# Altium project roach2_project.PrjPCB (part 8 of 13)

## Sheet v6_io_23_24_25_26.SchDoc: Virtex-6 IO Banks 23, 24, 25 & 26
size A3; Date: DO NOT USE, RATHER USE PROJ OPTIONS; DrawnBy: DO NOT USE, RATHER USE PROJ OPTIONS; Engineer: DO NOT USE, RATHER USE PROJ OPTIONS; Organization: DO NOT USE, RATHER USE PROJ OPTIONS; DocumentNumber: DO NOT USE, RATHER USE PROJ OPTIONS; Revision: DO NOT USE, RATHER USE PROJ OPTIONS; SheetNumber: 15; SheetTotal: 27; SCH_Sheet_Filename: v6_config_io_23_24_25_26.SchDoc; CurrentTime: DO NOT USE, RATHER USE PROJ OPTIONS; Time: DO NOT USE, RATHER USE PROJ OPTIONS; DocumentFullPathAndName: DO NOT USE, RATHER USE PROJ OPTIONS; DocumentName: DO NOT USE, RATHER USE PROJ OPTIONS; ModifiedDate: DO NOT USE, RATHER USE PROJ OPTIONS; ImagePath: DO NOT USE, RATHER USE PROJ OPTIONS
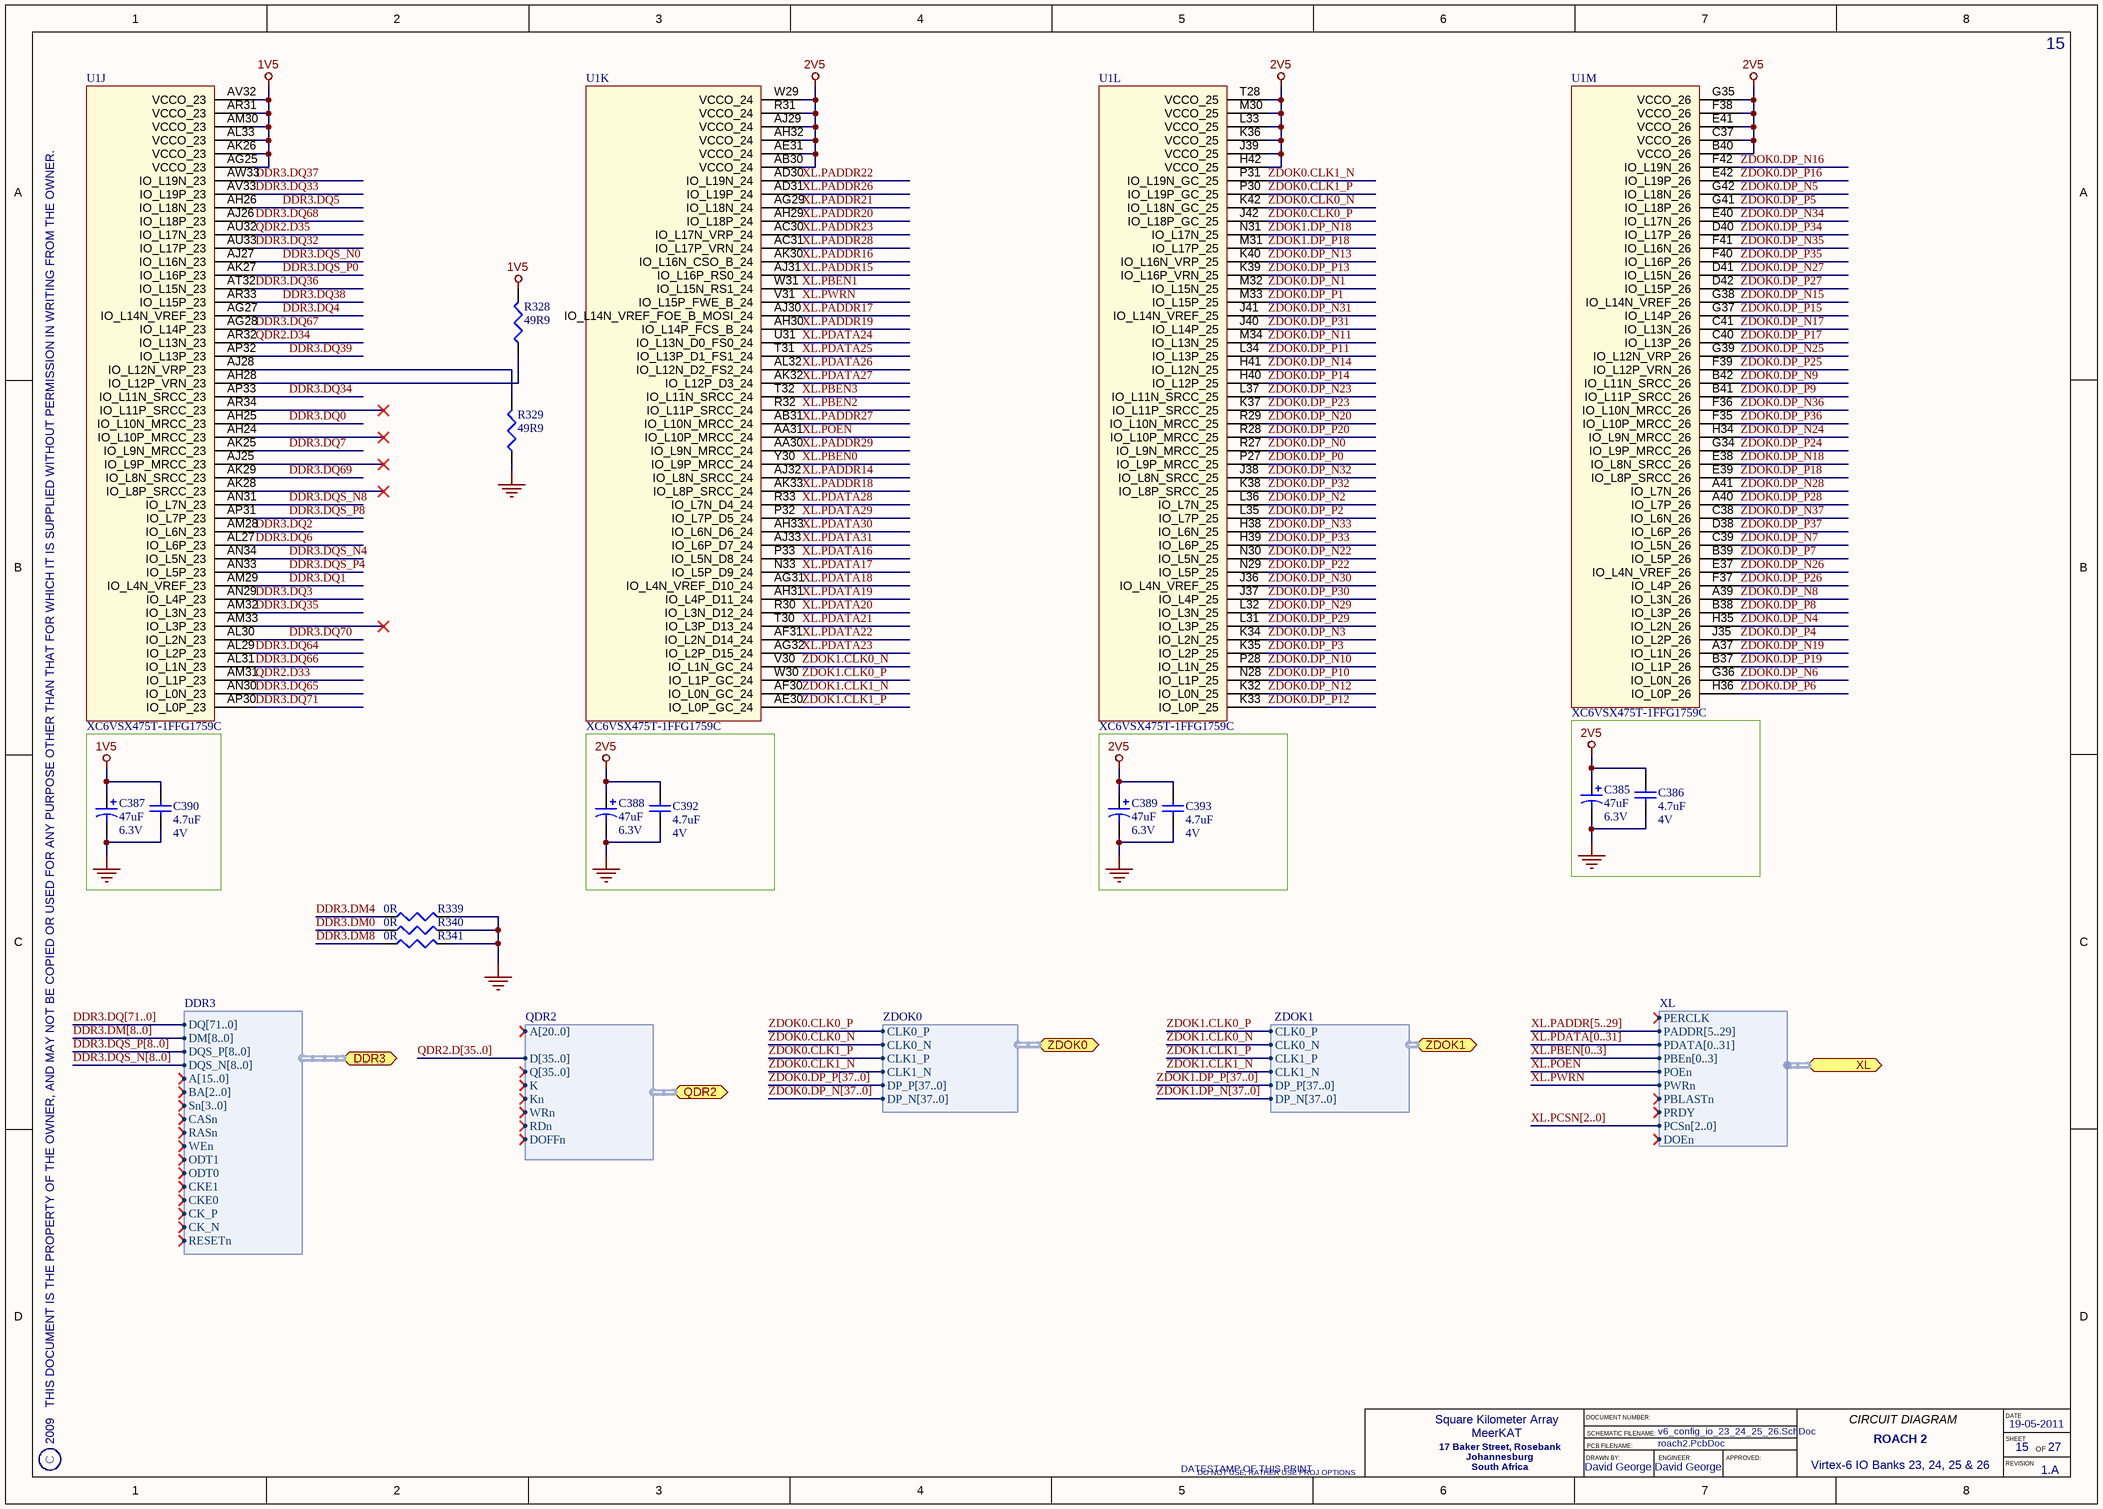
[diagram p15: v6_io_23_24_25_26.SchDoc]

### Parts
C385  Rating: 6.3V  [CAPMP3528X120L]  (hidden comment: 47uF)
C386  Rating: 4V  [CAPC1005X60L]  (hidden comment: 4.7uF)
C387  Rating: 6.3V  [CAPMP3528X120L]  (hidden comment: 47uF)
C388  Rating: 6.3V  [CAPMP3528X120L]  (hidden comment: 47uF)
C389  Rating: 6.3V  [CAPMP3528X120L]  (hidden comment: 47uF)
C390  Rating: 4V  [CAPC1005X60L]  (hidden comment: 4.7uF)
C392  Rating: 4V  [CAPC1005X60L]  (hidden comment: 4.7uF)
C393  Rating: 4V  [CAPC1005X60L]  (hidden comment: 4.7uF)
R328  49R9  [RESC1005X40L]
R329  49R9  [RESC1005X40L]
R339  0R  [RESC1005X40L]
R340  0R  [RESC1005X40L]
R341  0R  [RESC1005X40L]
U1  XC6VSX475T-1FFG1759C  [FFG1759]  (parts J,K,L,M of 39)

### Ports
DDR3 (harness DDR3), QDR2 (harness QDR2), XL (harness XL), ZDOK0 (harness ZDOK0), ZDOK1 (harness ZDOK1)

### Harnesses
ZDOK1: CLK0_P, CLK0_N, CLK1_P, CLK1_N, DP_P[37..0], DP_N[37..0]
QDR2: A[20..0], D[35..0], Q[35..0], K, Kn, WRn, RDn, DOFFn
DDR3: DQ[71..0], DM[8..0], DQS_P[8..0], DQS_N[8..0], A[15..0], BA[2..0], Sn[3..0], CASn, RASn, WEn, ODT1, ODT0, CKE1, CKE0, CK_P, CK_N, RESETn
ZDOK0: CLK0_P, CLK0_N, CLK1_P, CLK1_N, DP_P[37..0], DP_N[37..0]
XL: PERCLK, PADDR[5..29], PDATA[0..31], PBEn[0..3], POEn, PWRn, PBLASTn, PRDY, PCSn[2..0], DOEn

### Nets
1V5: C387.1 C390.2 R328.2 U1.AG25(VCCO_23) U1.AK26(VCCO_23) U1.AL33(VCCO_23) U1.AM30(VCCO_23) U1.AR31(VCCO_23) U1.AV32(VCCO_23)
2V5: C385.1 C386.2 C388.1 C389.1 C392.2 C393.2 U1.AB30(VCCO_24) U1.AE31(VCCO_24) U1.AH32(VCCO_24) U1.AJ29(VCCO_24) U1.B40(VCCO_26) U1.C37(VCCO_26) U1.E41(VCCO_26) U1.F38(VCCO_26) U1.G35(VCCO_26) U1.H42(VCCO_25) U1.J39(VCCO_25) U1.K36(VCCO_25) U1.L33(VCCO_25) U1.M30(VCCO_25) U1.R31(VCCO_24) U1.T28(VCCO_25) U1.W29(VCCO_24)
GND: C385.2 C386.1 C387.2 C388.2 C389.2 C390.1 C392.1 C393.1 R329.1 R339.2 R340.2 R341.2
DDR3.DM0: R340.1
DDR3.DM4: R339.1
DDR3.DM8: R341.1
DDR3.DQ0: U1.AH25(IO_L10N_MRCC_23)
DDR3.DQ1: U1.AM29(IO_L4N_VREF_23)
DDR3.DQ2: U1.AM28(IO_L6N_23)
DDR3.DQ3: U1.AN29(IO_L4P_23)
DDR3.DQ4: U1.AG27(IO_L14N_VREF_23)
DDR3.DQ5: U1.AH26(IO_L18N_23)
DDR3.DQ6: U1.AL27(IO_L6P_23)
DDR3.DQ7: U1.AK25(IO_L9N_MRCC_23)
DDR3.DQ32: U1.AU33(IO_L17P_23)
DDR3.DQ33: U1.AV33(IO_L19P_23)
DDR3.DQ34: U1.AP33(IO_L11N_SRCC_23)
DDR3.DQ35: U1.AM32(IO_L3N_23)
DDR3.DQ36: U1.AT32(IO_L15N_23)
DDR3.DQ37: U1.AW33(IO_L19N_23)
DDR3.DQ38: U1.AR33(IO_L15P_23)
DDR3.DQ39: U1.AP32(IO_L13P_23)
DDR3.DQ64: U1.AL29(IO_L2P_23)
DDR3.DQ65: U1.AN30(IO_L0N_23)
DDR3.DQ66: U1.AL31(IO_L1N_23)
DDR3.DQ67: U1.AG28(IO_L14P_23)
DDR3.DQ68: U1.AJ26(IO_L18P_23)
DDR3.DQ69: U1.AK29(IO_L8N_SRCC_23)
DDR3.DQ70: U1.AL30(IO_L2N_23)
DDR3.DQ71: U1.AP30(IO_L0P_23)
DDR3.DQS_N0: U1.AJ27(IO_L16N_23)
DDR3.DQS_N4: U1.AN34(IO_L5N_23)
DDR3.DQS_N8: U1.AN31(IO_L7N_23)
DDR3.DQS_P0: U1.AK27(IO_L16P_23)
DDR3.DQS_P4: U1.AN33(IO_L5P_23)
DDR3.DQS_P8: U1.AP31(IO_L7P_23)
QDR2.D33: U1.AM31(IO_L1P_23)
QDR2.D34: U1.AR32(IO_L13N_23)
QDR2.D35: U1.AU32(IO_L17N_23)
XL.PADDR14: U1.AJ32(IO_L8N_SRCC_24)
XL.PADDR15: U1.AJ31(IO_L16P_RS0_24)
XL.PADDR16: U1.AK30(IO_L16N_CSO_B_24)
XL.PADDR17: U1.AJ30(IO_L14N_VREF_FOE_B_MOSI_24)
XL.PADDR18: U1.AK33(IO_L8P_SRCC_24)
XL.PADDR19: U1.AH30(IO_L14P_FCS_B_24)
XL.PADDR20: U1.AH29(IO_L18P_24)
XL.PADDR21: U1.AG29(IO_L18N_24)
XL.PADDR22: U1.AD30(IO_L19N_24)
XL.PADDR23: U1.AC30(IO_L17N_VRP_24)
XL.PADDR26: U1.AD31(IO_L19P_24)
XL.PADDR27: U1.AB31(IO_L10N_MRCC_24)
XL.PADDR28: U1.AC31(IO_L17P_VRN_24)
XL.PADDR29: U1.AA30(IO_L9N_MRCC_24)
XL.PBEn0: U1.Y30(IO_L9P_MRCC_24)
XL.PBEn1: U1.W31(IO_L15N_RS1_24)
XL.PBEn2: U1.R32(IO_L11P_SRCC_24)
XL.PBEn3: U1.T32(IO_L11N_SRCC_24)
XL.PDATA16: U1.P33(IO_L5N_D8_24)
XL.PDATA17: U1.N33(IO_L5P_D9_24)
XL.PDATA18: U1.AG31(IO_L4N_VREF_D10_24)
XL.PDATA19: U1.AH31(IO_L4P_D11_24)
XL.PDATA20: U1.R30(IO_L3N_D12_24)
XL.PDATA21: U1.T30(IO_L3P_D13_24)
XL.PDATA22: U1.AF31(IO_L2N_D14_24)
XL.PDATA23: U1.AG32(IO_L2P_D15_24)
XL.PDATA24: U1.U31(IO_L13N_D0_FS0_24)
XL.PDATA25: U1.T31(IO_L13P_D1_FS1_24)
XL.PDATA26: U1.AL32(IO_L12N_D2_FS2_24)
XL.PDATA27: U1.AK32(IO_L12P_D3_24)
XL.PDATA28: U1.R33(IO_L7N_D4_24)
XL.PDATA29: U1.P32(IO_L7P_D5_24)
XL.PDATA30: U1.AH33(IO_L6N_D6_24)
XL.PDATA31: U1.AJ33(IO_L6P_D7_24)
XL.POEn: U1.AA31(IO_L10P_MRCC_24) ; port XL.POEn
XL.PWRn: U1.V31(IO_L15P_FWE_B_24) ; port XL.PWRn
ZDOK0.CLK0_N: U1.K42(IO_L18N_GC_25) ; port ZDOK0.CLK0_N
ZDOK0.CLK0_P: U1.J42(IO_L18P_GC_25) ; port ZDOK0.CLK0_P
ZDOK0.CLK1_N: U1.P31(IO_L19N_GC_25) ; port ZDOK0.CLK1_N
ZDOK0.CLK1_P: U1.P30(IO_L19P_GC_25) ; port ZDOK0.CLK1_P
ZDOK0.DP_N0: U1.R27(IO_L9N_MRCC_25)
ZDOK0.DP_N1: U1.M32(IO_L15N_25)
ZDOK0.DP_N2: U1.L36(IO_L7N_25)
ZDOK0.DP_N3: U1.K34(IO_L2N_25)
ZDOK0.DP_N4: U1.H35(IO_L2N_26)
ZDOK0.DP_N5: U1.G42(IO_L18N_26)
ZDOK0.DP_N6: U1.G36(IO_L0N_26)
ZDOK0.DP_N7: U1.C39(IO_L5N_26)
ZDOK0.DP_N8: U1.A39(IO_L3N_26)
ZDOK0.DP_N9: U1.B42(IO_L11N_SRCC_26)
ZDOK0.DP_N10: U1.P28(IO_L1N_25)
ZDOK0.DP_N11: U1.M34(IO_L13N_25)
ZDOK0.DP_N12: U1.K32(IO_L0N_25)
ZDOK0.DP_N13: U1.K40(IO_L16N_VRP_25)
ZDOK0.DP_N14: U1.H41(IO_L12N_25)
ZDOK0.DP_N15: U1.G38(IO_L14N_VREF_26)
ZDOK0.DP_N16: U1.F42(IO_L19N_26)
ZDOK0.DP_N17: U1.C41(IO_L13N_26)
ZDOK0.DP_N18: U1.E38(IO_L8N_SRCC_26)
ZDOK0.DP_N19: U1.A37(IO_L1N_26)
ZDOK0.DP_N20: U1.R29(IO_L10N_MRCC_25)
ZDOK0.DP_N22: U1.N30(IO_L5N_25)
ZDOK0.DP_N23: U1.L37(IO_L11N_SRCC_25)
ZDOK0.DP_N24: U1.H34(IO_L9N_MRCC_26)
ZDOK0.DP_N25: U1.G39(IO_L12N_VRP_26)
ZDOK0.DP_N26: U1.E37(IO_L4N_VREF_26)
ZDOK0.DP_N27: U1.D41(IO_L15N_26)
ZDOK0.DP_N28: U1.A41(IO_L7N_26)
ZDOK0.DP_N29: U1.L32(IO_L3N_25)
ZDOK0.DP_N30: U1.J36(IO_L4N_VREF_25)
ZDOK0.DP_N31: U1.J41(IO_L14N_VREF_25)
ZDOK0.DP_N32: U1.J38(IO_L8N_SRCC_25)
ZDOK0.DP_N33: U1.H38(IO_L6N_25)
ZDOK0.DP_N34: U1.E40(IO_L17N_26)
ZDOK0.DP_N35: U1.F41(IO_L16N_26)
ZDOK0.DP_N36: U1.F36(IO_L10N_MRCC_26)
ZDOK0.DP_N37: U1.C38(IO_L6N_26)
ZDOK0.DP_P0: U1.P27(IO_L9P_MRCC_25)
ZDOK0.DP_P1: U1.M33(IO_L15P_25)
ZDOK0.DP_P2: U1.L35(IO_L7P_25)
ZDOK0.DP_P3: U1.K35(IO_L2P_25)
ZDOK0.DP_P4: U1.J35(IO_L2P_26)
ZDOK0.DP_P5: U1.G41(IO_L18P_26)
ZDOK0.DP_P6: U1.H36(IO_L0P_26)
ZDOK0.DP_P7: U1.B39(IO_L5P_26)
ZDOK0.DP_P8: U1.B38(IO_L3P_26)
ZDOK0.DP_P9: U1.B41(IO_L11P_SRCC_26)
ZDOK0.DP_P10: U1.N28(IO_L1P_25)
ZDOK0.DP_P11: U1.L34(IO_L13P_25)
ZDOK0.DP_P12: U1.K33(IO_L0P_25)
ZDOK0.DP_P13: U1.K39(IO_L16P_VRN_25)
ZDOK0.DP_P14: U1.H40(IO_L12P_25)
ZDOK0.DP_P15: U1.G37(IO_L14P_26)
ZDOK0.DP_P16: U1.E42(IO_L19P_26)
ZDOK0.DP_P17: U1.C40(IO_L13P_26)
ZDOK0.DP_P18: U1.E39(IO_L8P_SRCC_26)
ZDOK0.DP_P19: U1.B37(IO_L1P_26)
ZDOK0.DP_P20: U1.R28(IO_L10P_MRCC_25)
ZDOK0.DP_P22: U1.N29(IO_L5P_25)
ZDOK0.DP_P23: U1.K37(IO_L11P_SRCC_25)
ZDOK0.DP_P24: U1.G34(IO_L9P_MRCC_26)
ZDOK0.DP_P25: U1.F39(IO_L12P_VRN_26)
ZDOK0.DP_P26: U1.F37(IO_L4P_26)
ZDOK0.DP_P27: U1.D42(IO_L15P_26)
ZDOK0.DP_P28: U1.A40(IO_L7P_26)
ZDOK0.DP_P29: U1.L31(IO_L3P_25)
ZDOK0.DP_P30: U1.J37(IO_L4P_25)
ZDOK0.DP_P31: U1.J40(IO_L14P_25)
ZDOK0.DP_P32: U1.K38(IO_L8P_SRCC_25)
ZDOK0.DP_P33: U1.H39(IO_L6P_25)
ZDOK0.DP_P34: U1.D40(IO_L17P_26)
ZDOK0.DP_P35: U1.F40(IO_L16P_26)
ZDOK0.DP_P36: U1.F35(IO_L10P_MRCC_26)
ZDOK0.DP_P37: U1.D38(IO_L6P_26)
ZDOK1.CLK0_N: U1.V30(IO_L1N_GC_24) ; port ZDOK1.CLK0_N
ZDOK1.CLK0_P: U1.W30(IO_L1P_GC_24) ; port ZDOK1.CLK0_P
ZDOK1.CLK1_N: U1.AF30(IO_L0N_GC_24) ; port ZDOK1.CLK1_N
ZDOK1.CLK1_P: U1.AE30(IO_L0P_GC_24) ; port ZDOK1.CLK1_P
ZDOK1.DP_N18: U1.N31(IO_L17N_25)
ZDOK1.DP_P18: U1.M31(IO_L17P_25)
NetR328_1: R328.1 U1.AH28(IO_L12P_VRN_23)
NetR329_2: R329.2 U1.AJ28(IO_L12N_VRP_23)

Not connected (* = marked no-connect by the designer): U1 AH24(IO_L10P_MRCC_23)* AJ25(IO_L9P_MRCC_23)* AK28(IO_L8P_SRCC_23)* AM33(IO_L3P_23)* AR34(IO_L11P_SRCC_23)*

### Buses and harness runs
bus DDR3.DM[8..0]
bus DDR3.DQ[71..0]
bus DDR3.DQS_N[8..0]
bus DDR3.DQS_P[8..0]
bus QDR2.D[35..0]
bus XL.PADDR[5..29]
bus XL.PBEN[0..3]
bus XL.PCSN[2..0]
bus XL.PDATA[0..31]
bus ZDOK0.DP_N[37..0]
bus ZDOK0.DP_P[37..0]
bus ZDOK1.DP_N[37..0]
bus ZDOK1.DP_P[37..0]

### Notes on the sheet
- 2009   THIS DOCUMENT IS THE PROPERTY OF THE OWNER, AND MAY NOT BE COPIED OR USED FOR ANY PURPOSE OTHER THAN THAT FOR WHICH IT IS SUPPLIED WITHOUT PERMISSION IN WRITING FROM THE OWNER.
- C
- DATESTAMP OF THIS PRINT
- DRAWN BY:
- DOCUMENT NUMBER:
- SCHEMATIC FILENAME:
- PCB FILENAME:
- ENGINEER:
- APPROVED:
- CIRCUIT DIAGRAM
- DATE
- SHEET
- REVISION
- OF

### Library data of the parts
C385 C387-C389 = CAP-TAN-1: 47uF, Conductive Polymer Chip Capacitor; Manufacturer: KEMET; PartNum: T520T476M006ATE070; Tolerance: 20%; ESR: 0.07; POD number: CAP-TAN-1; Value: 47uF; RoHS: Y; Sort Value: 47; Category: Capacitors; Subcategory: Tantalum
C386 C390 C392 C393 = CAP-CER-11: 4.7uF, Ceramic Capacitor; Manufacturer: MURATA; PartNum: AMK105BJ475MV-F; Tolerance: 20%; Dielectric: X5R; POD number: CAP-CER-11; Value: 4.7uF; RoHS: Y; Sort Value: 4.7; Category: Capacitors; Subcategory: Ceramic
R328 R329 = RES-TF-10: 49R9, 1.1mm x 0.5mm, Thick Film Resistor; Manufacturer: ROYALOHM; PartNum: 0402WGF499JT1E; Tolerance: 1%; Rating: 0.0625W; POD number: RES-TF-10; Value: 49R9; Sort Value: 49.9; Category: Resistors; Subcategory: ThickFilm; HelpURL: *.pdf
R339-R341 = RES-TF-0: 0R, 1.1mm x 0.5mm, Thick Film Resistor; Manufacturer: ROYALOHM; PartNum: 0402WG00000T1E; Tolerance: 0%; Rating: 0.0625W; POD number: RES-TF-0; Value: 0R; Sort Value: 0; Category: Resistors; Subcategory: ThickFilm; HelpURL: *.pdf
U1 = IC-PLD-0: Virtex-6 475SXT 1760-pin FPGA; Manufacturer: Xilinx; POD number: IC-PLD-0; PartNum: XC6VSX475T-1FFG1759C; RoHS: Y; Category: IC; Subcategory: PLD

## Sheet v6_io_27_28_32_33.SchDoc: Virtex-6 IO Banks 27, 28, 32 & 33
size A3; Date: DO NOT USE, RATHER USE PROJ OPTIONS; DrawnBy: DO NOT USE, RATHER USE PROJ OPTIONS; Engineer: DO NOT USE, RATHER USE PROJ OPTIONS; Organization: DO NOT USE, RATHER USE PROJ OPTIONS; DocumentNumber: DO NOT USE, RATHER USE PROJ OPTIONS; Revision: DO NOT USE, RATHER USE PROJ OPTIONS; SheetNumber: 16; SheetTotal: 27; SCH_Sheet_Filename: v6_io_27_28_32_33.SchDoc; CurrentTime: DO NOT USE, RATHER USE PROJ OPTIONS; Time: DO NOT USE, RATHER USE PROJ OPTIONS; DocumentFullPathAndName: DO NOT USE, RATHER USE PROJ OPTIONS; DocumentName: DO NOT USE, RATHER USE PROJ OPTIONS; ModifiedDate: DO NOT USE, RATHER USE PROJ OPTIONS; ImagePath: DO NOT USE, RATHER USE PROJ OPTIONS
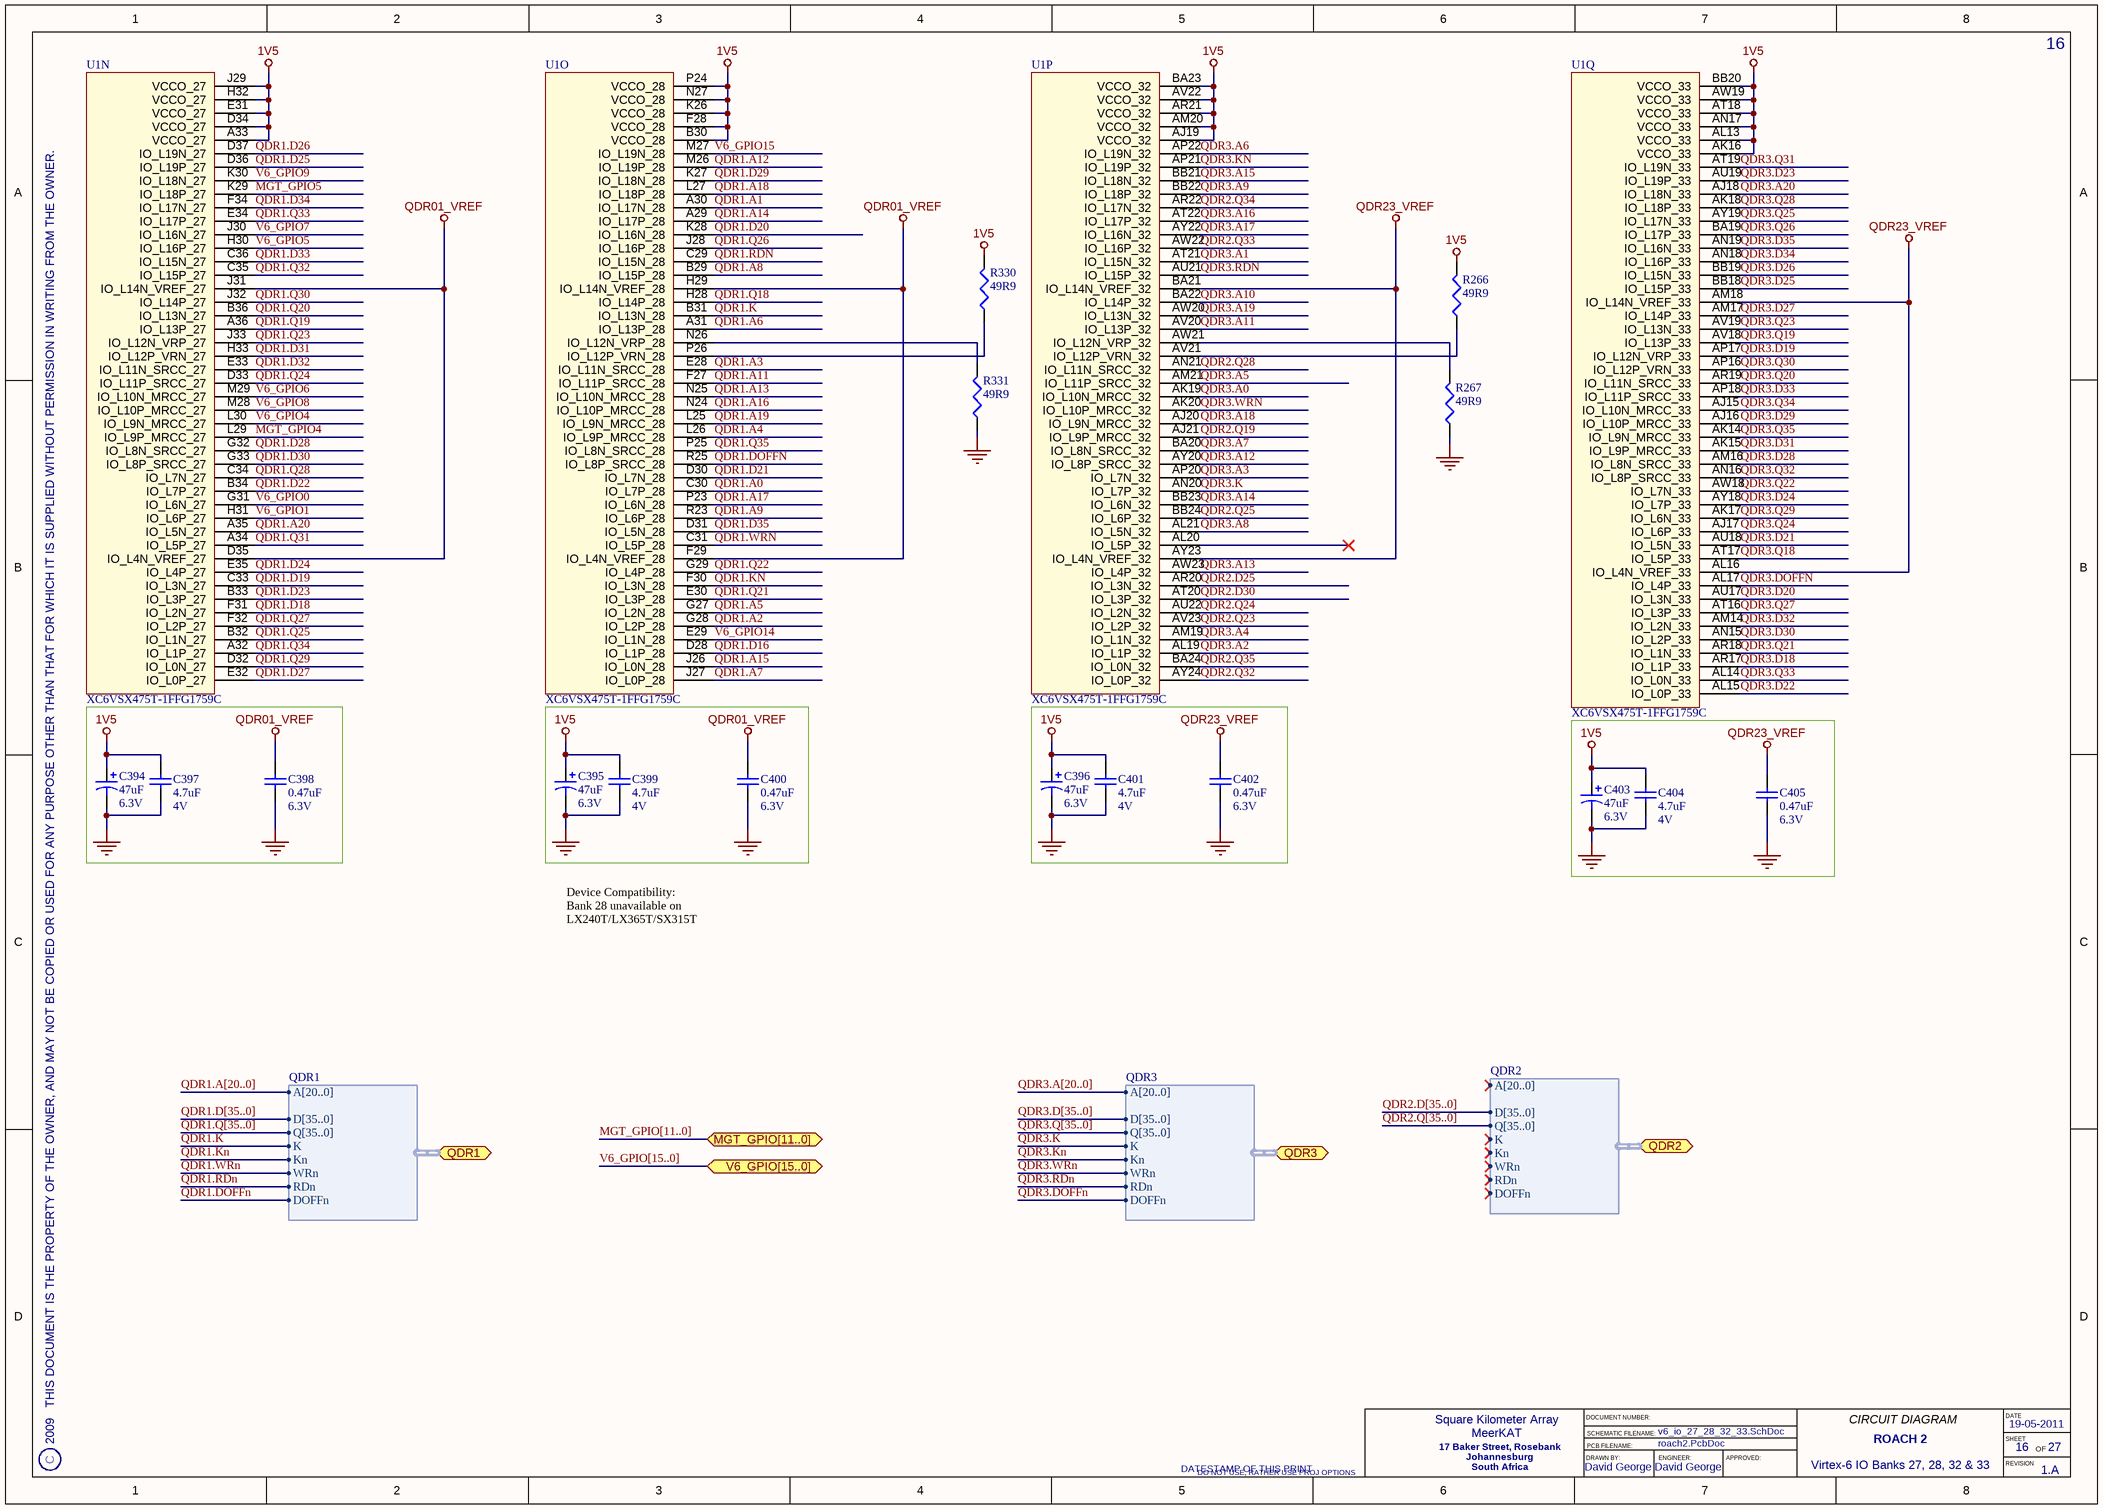
[diagram p16: v6_io_27_28_32_33.SchDoc]

### Parts
C394  Rating: 6.3V  [CAPMP3528X120L]  (hidden comment: 47uF)
C395  Rating: 6.3V  [CAPMP3528X120L]  (hidden comment: 47uF)
C396  Rating: 6.3V  [CAPMP3528X120L]  (hidden comment: 47uF)
C397  Rating: 4V  [CAPC1005X60L]  (hidden comment: 4.7uF)
C398  Rating: 6.3V  [CAPC1005X55L]  (hidden comment: 0.47uF)
C399  Rating: 4V  [CAPC1005X60L]  (hidden comment: 4.7uF)
C400  Rating: 6.3V  [CAPC1005X55L]  (hidden comment: 0.47uF)
C401  Rating: 4V  [CAPC1005X60L]  (hidden comment: 4.7uF)
C402  Rating: 6.3V  [CAPC1005X55L]  (hidden comment: 0.47uF)
C403  Rating: 6.3V  [CAPMP3528X120L]  (hidden comment: 47uF)
C404  Rating: 4V  [CAPC1005X60L]  (hidden comment: 4.7uF)
C405  Rating: 6.3V  [CAPC1005X55L]  (hidden comment: 0.47uF)
R266  49R9  [RESC1005X40L]
R267  49R9  [RESC1005X40L]
R330  49R9  [RESC1005X40L]
R331  49R9  [RESC1005X40L]
U1  XC6VSX475T-1FFG1759C  [FFG1759]  (parts N,O,P,Q of 39)

### Ports
MGT_GPIO[11..0] (bidir), QDR1 (harness QDR1), QDR2 (harness QDR2), QDR3 (harness QDR3), V6_GPIO[15..0] (bidir)

### Harnesses
QDR1: A[20..0], D[35..0], Q[35..0], K, Kn, WRn, RDn, DOFFn
QDR3: A[20..0], D[35..0], Q[35..0], K, Kn, WRn, RDn, DOFFn
QDR2: A[20..0], D[35..0], Q[35..0], K, Kn, WRn, RDn, DOFFn

### Nets
1V5: C394.1 C395.1 C396.1 C397.2 C399.2 C401.2 C403.1 C404.2 R266.2 R330.2 U1.A33(VCCO_27) U1.AJ19(VCCO_32) U1.AK16(VCCO_33) U1.AL13(VCCO_33) U1.AM20(VCCO_32) U1.AN17(VCCO_33) U1.AR21(VCCO_32) U1.AT18(VCCO_33) U1.AV22(VCCO_32) U1.AW19(VCCO_33) U1.B30(VCCO_28) U1.BA23(VCCO_32) U1.BB20(VCCO_33) U1.D34(VCCO_27) U1.E31(VCCO_27) U1.F28(VCCO_28) U1.H32(VCCO_27) U1.J29(VCCO_27) U1.K26(VCCO_28) U1.N27(VCCO_28) U1.P24(VCCO_28)
GND: C394.2 C395.2 C396.2 C397.1 C398.1 C399.1 C400.1 C401.1 C402.1 C403.2 C404.1 C405.1 R267.1 R331.1
QDR01_VREF: C398.2 C400.2 U1.D35(IO_L4N_VREF_27) U1.F29(IO_L4N_VREF_28) U1.H29(IO_L14N_VREF_28) U1.J31(IO_L14N_VREF_27)
QDR23_VREF: C402.2 C405.2 U1.AL16(IO_L4N_VREF_33) U1.AM18(IO_L14N_VREF_33) U1.AY23(IO_L4N_VREF_32) U1.BA21(IO_L14N_VREF_32)
MGT_GPIO4: U1.L29(IO_L9P_MRCC_27)
MGT_GPIO5: U1.K29(IO_L18P_27)
QDR1.A0: U1.C30(IO_L7P_28)
QDR1.A1: U1.A30(IO_L17N_28)
QDR1.A2: U1.G28(IO_L2P_28)
QDR1.A3: U1.E28(IO_L11N_SRCC_28)
QDR1.A4: U1.L26(IO_L9P_MRCC_28)
QDR1.A5: U1.G27(IO_L2N_28)
QDR1.A6: U1.A31(IO_L13P_28)
QDR1.A7: U1.J27(IO_L0P_28)
QDR1.A8: U1.B29(IO_L15P_28)
QDR1.A9: U1.R23(IO_L6P_28)
QDR1.A11: U1.F27(IO_L11P_SRCC_28)
QDR1.A12: U1.M26(IO_L19P_28)
QDR1.A13: U1.N25(IO_L10N_MRCC_28)
QDR1.A14: U1.A29(IO_L17P_28)
QDR1.A15: U1.J26(IO_L0N_28)
QDR1.A16: U1.N24(IO_L10P_MRCC_28)
QDR1.A17: U1.P23(IO_L6N_28)
QDR1.A18: U1.L27(IO_L18P_28)
QDR1.A19: U1.L25(IO_L9N_MRCC_28)
QDR1.A20: U1.A35(IO_L5N_27)
QDR1.D16: U1.D28(IO_L1P_28)
QDR1.D18: U1.F31(IO_L2N_27)
QDR1.D19: U1.C33(IO_L3N_27)
QDR1.D20: U1.K28(IO_L16N_28)
QDR1.D21: U1.D30(IO_L7N_28)
QDR1.D22: U1.B34(IO_L7P_27)
QDR1.D23: U1.B33(IO_L3P_27)
QDR1.D24: U1.E35(IO_L4P_27)
QDR1.D25: U1.D36(IO_L19P_27)
QDR1.D26: U1.D37(IO_L19N_27)
QDR1.D27: U1.E32(IO_L0P_27)
QDR1.D28: U1.G32(IO_L8N_SRCC_27)
QDR1.D29: U1.K27(IO_L18N_28)
QDR1.D30: U1.G33(IO_L8P_SRCC_27)
QDR1.D31: U1.H33(IO_L12P_VRN_27)
QDR1.D32: U1.E33(IO_L11N_SRCC_27)
QDR1.D33: U1.C36(IO_L15N_27)
QDR1.D34: U1.F34(IO_L17N_27)
QDR1.D35: U1.D31(IO_L5N_28)
QDR1.DOFFn: U1.R25(IO_L8P_SRCC_28) ; port QDR1.DOFFn
QDR1.K: U1.B31(IO_L13N_28) ; port QDR1.K
QDR1.Kn: U1.F30(IO_L3N_28) ; port QDR1.Kn
QDR1.Q18: U1.H28(IO_L14P_28)
QDR1.Q19: U1.A36(IO_L13P_27)
QDR1.Q20: U1.B36(IO_L13N_27)
QDR1.Q21: U1.E30(IO_L3P_28)
QDR1.Q22: U1.G29(IO_L4P_28)
QDR1.Q23: U1.J33(IO_L12N_VRP_27)
QDR1.Q24: U1.D33(IO_L11P_SRCC_27)
QDR1.Q25: U1.B32(IO_L1N_27)
QDR1.Q26: U1.J28(IO_L16P_28)
QDR1.Q27: U1.F32(IO_L2P_27)
QDR1.Q28: U1.C34(IO_L7N_27)
QDR1.Q29: U1.D32(IO_L0N_27)
QDR1.Q30: U1.J32(IO_L14P_27)
QDR1.Q31: U1.A34(IO_L5P_27)
QDR1.Q32: U1.C35(IO_L15P_27)
QDR1.Q33: U1.E34(IO_L17P_27)
QDR1.Q34: U1.A32(IO_L1P_27)
QDR1.Q35: U1.P25(IO_L8N_SRCC_28)
QDR1.RDn: U1.C29(IO_L15N_28) ; port QDR1.RDn
QDR1.WRn: U1.C31(IO_L5P_28) ; port QDR1.WRn
QDR2.D25: U1.AR20(IO_L3N_32)
QDR2.D30: U1.AT20(IO_L3P_32)
QDR2.Q19: U1.AJ21(IO_L9P_MRCC_32)
QDR2.Q23: U1.AV23(IO_L2P_32)
QDR2.Q24: U1.AU22(IO_L2N_32)
QDR2.Q25: U1.BB24(IO_L6P_32)
QDR2.Q28: U1.AN21(IO_L11N_SRCC_32)
QDR2.Q32: U1.AY24(IO_L0P_32)
QDR2.Q33: U1.AW22(IO_L16P_32)
QDR2.Q34: U1.AR22(IO_L17N_32)
QDR2.Q35: U1.BA24(IO_L0N_32)
QDR3.A0: U1.AK19(IO_L10N_MRCC_32)
QDR3.A1: U1.AT21(IO_L15N_32)
QDR3.A2: U1.AL19(IO_L1P_32)
QDR3.A3: U1.AP20(IO_L7N_32)
QDR3.A4: U1.AM19(IO_L1N_32)
QDR3.A5: U1.AM21(IO_L11P_SRCC_32)
QDR3.A6: U1.AP22(IO_L19N_32)
QDR3.A7: U1.BA20(IO_L8N_SRCC_32)
QDR3.A8: U1.AL21(IO_L5N_32)
QDR3.A9: U1.BB22(IO_L18P_32)
QDR3.A10: U1.BA22(IO_L14P_32)
QDR3.A11: U1.AV20(IO_L13P_32)
QDR3.A12: U1.AY20(IO_L8P_SRCC_32)
QDR3.A13: U1.AW23(IO_L4P_32)
QDR3.A14: U1.BB23(IO_L6N_32)
QDR3.A15: U1.BB21(IO_L18N_32)
QDR3.A16: U1.AT22(IO_L17P_32)
QDR3.A17: U1.AY22(IO_L16N_32)
QDR3.A18: U1.AJ20(IO_L9N_MRCC_32)
QDR3.A19: U1.AW20(IO_L13N_32)
QDR3.A20: U1.AJ18(IO_L18N_33)
QDR3.D18: U1.AR17(IO_L1P_33)
QDR3.D19: U1.AP17(IO_L12N_VRP_33)
QDR3.D20: U1.AU17(IO_L3N_33)
QDR3.D21: U1.AU18(IO_L5N_33)
QDR3.D22: U1.AL15(IO_L0P_33)
QDR3.D23: U1.AU19(IO_L19P_33)
QDR3.D24: U1.AY18(IO_L7P_33)
QDR3.D25: U1.BB18(IO_L15P_33)
QDR3.D26: U1.BB19(IO_L15N_33)
QDR3.D27: U1.AM17(IO_L14P_33)
QDR3.D28: U1.AM16(IO_L8N_SRCC_33)
QDR3.D29: U1.AJ16(IO_L10P_MRCC_33)
QDR3.D30: U1.AN15(IO_L2P_33)
QDR3.D31: U1.AK15(IO_L9P_MRCC_33)
QDR3.D32: U1.AM14(IO_L2N_33)
QDR3.D33: U1.AP18(IO_L11P_SRCC_33)
QDR3.D34: U1.AN18(IO_L16P_33)
QDR3.D35: U1.AN19(IO_L16N_33)
QDR3.DOFFn: U1.AL17(IO_L4P_33) ; port QDR3.DOFFn
QDR3.K: U1.AN20(IO_L7P_32) ; port QDR3.K
QDR3.Kn: U1.AP21(IO_L19P_32) ; port QDR3.Kn
QDR3.Q18: U1.AT17(IO_L5P_33)
QDR3.Q19: U1.AV18(IO_L13P_33)
QDR3.Q20: U1.AR19(IO_L11N_SRCC_33)
QDR3.Q21: U1.AR18(IO_L1N_33)
QDR3.Q22: U1.AW18(IO_L7N_33)
QDR3.Q23: U1.AV19(IO_L13N_33)
QDR3.Q24: U1.AJ17(IO_L6P_33)
QDR3.Q25: U1.AY19(IO_L17N_33)
QDR3.Q26: U1.BA19(IO_L17P_33)
QDR3.Q27: U1.AT16(IO_L3P_33)
QDR3.Q28: U1.AK18(IO_L18P_33)
QDR3.Q29: U1.AK17(IO_L6N_33)
QDR3.Q30: U1.AP16(IO_L12P_VRN_33)
QDR3.Q31: U1.AT19(IO_L19N_33)
QDR3.Q32: U1.AN16(IO_L8P_SRCC_33)
QDR3.Q33: U1.AL14(IO_L0N_33)
QDR3.Q34: U1.AJ15(IO_L10N_MRCC_33)
QDR3.Q35: U1.AK14(IO_L9N_MRCC_33)
QDR3.RDn: U1.AU21(IO_L15P_32) ; port QDR3.RDn
QDR3.WRn: U1.AK20(IO_L10P_MRCC_32) ; port QDR3.WRn
V6_GPIO0: U1.G31(IO_L6N_27)
V6_GPIO1: U1.H31(IO_L6P_27)
V6_GPIO4: U1.L30(IO_L9N_MRCC_27)
V6_GPIO5: U1.H30(IO_L16P_27)
V6_GPIO6: U1.M29(IO_L10N_MRCC_27)
V6_GPIO7: U1.J30(IO_L16N_27)
V6_GPIO8: U1.M28(IO_L10P_MRCC_27)
V6_GPIO9: U1.K30(IO_L18N_27)
V6_GPIO14: U1.E29(IO_L1N_28)
V6_GPIO15: U1.M27(IO_L19N_28)
NetR266_1: R266.1 U1.AV21(IO_L12P_VRN_32)
NetR267_2: R267.2 U1.AW21(IO_L12N_VRP_32)
NetR330_1: R330.1 U1.P26(IO_L12P_VRN_28)
NetR331_2: R331.2 U1.N26(IO_L12N_VRP_28)

Not connected (* = marked no-connect by the designer): U1 AL20(IO_L5P_32)*

### Buses and harness runs
bus MGT_GPIO[11..0] = port MGT_GPIO[11..0]
bus QDR1.A[20..0]
bus QDR1.D[35..0]
bus QDR1.Q[35..0]
bus QDR2.D[35..0]
bus QDR2.Q[35..0]
bus QDR3.A[20..0]
bus QDR3.D[35..0]
bus QDR3.Q[35..0]
bus V6_GPIO[15..0] = port V6_GPIO[15..0]

### Notes on the sheet
- Device Compatibility:
  Bank 28 unavailable on LX240T/LX365T/SX315T
- 2009   THIS DOCUMENT IS THE PROPERTY OF THE OWNER, AND MAY NOT BE COPIED OR USED FOR ANY PURPOSE OTHER THAN THAT FOR WHICH IT IS SUPPLIED WITHOUT PERMISSION IN WRITING FROM THE OWNER.
- C
- DATESTAMP OF THIS PRINT
- DRAWN BY:
- DOCUMENT NUMBER:
- SCHEMATIC FILENAME:
- PCB FILENAME:
- ENGINEER:
- APPROVED:
- CIRCUIT DIAGRAM
- DATE
- SHEET
- REVISION
- OF

### Library data of the parts
C394-C396 C403 = CAP-TAN-1: as C385 on sheet v6_io_23_24_25_26; POD number: CAP-TAN-1; Value: 47uF; RoHS: Y; Sort Value: 47; Category: Capacitors; Subcategory: Tantalum
C397 C399 C401 C404 = CAP-CER-11: as C386 on sheet v6_io_23_24_25_26; POD number: CAP-CER-11; Value: 4.7uF; RoHS: Y; Sort Value: 4.7; Category: Capacitors; Subcategory: Ceramic
C398 C400 C402 C405 = CAP-CER-7: 0.47uF, Ceramic Capacitor; Manufacturer: MURATA; PartNum: GRM155R60J474KE19; Tolerance: 10%; Dielectric: X5R; POD number: CAP-CER-7; Value: 0.47uF; RoHS: Y; Sort Value: 0.47; Category: Capacitors; Subcategory: Ceramic
R266 R267 R330 R331 = RES-TF-10: as R328 on sheet v6_io_23_24_25_26; POD number: RES-TF-10; Value: 49R9; Sort Value: 49.9; Category: Resistors; Subcategory: ThickFilm; HelpURL: *.pdf
U1 = IC-PLD-0: as U1 on sheet v6_io_23_24_25_26; POD number: IC-PLD-0; PartNum: XC6VSX475T-1FFG1759C; RoHS: Y; Category: IC; Subcategory: PLD

## Sheet v6_io_34_35_36_37_38.SchDoc: Virtex-6 IO Banks 34, 35,36,37 & 38
size A3; Date: DO NOT USE, RATHER USE PROJ OPTIONS; DrawnBy: DO NOT USE, RATHER USE PROJ OPTIONS; Engineer: DO NOT USE, RATHER USE PROJ OPTIONS; Organization: DO NOT USE, RATHER USE PROJ OPTIONS; DocumentNumber: DO NOT USE, RATHER USE PROJ OPTIONS; Revision: DO NOT USE, RATHER USE PROJ OPTIONS; SheetNumber: 17; SheetTotal: 27; SCH_Sheet_Filename: v6_io_34_35_36_37_38.SchDoc; CurrentTime: DO NOT USE, RATHER USE PROJ OPTIONS; Time: DO NOT USE, RATHER USE PROJ OPTIONS; DocumentFullPathAndName: DO NOT USE, RATHER USE PROJ OPTIONS; DocumentName: DO NOT USE, RATHER USE PROJ OPTIONS; ModifiedDate: DO NOT USE, RATHER USE PROJ OPTIONS; ImagePath: DO NOT USE, RATHER USE PROJ OPTIONS
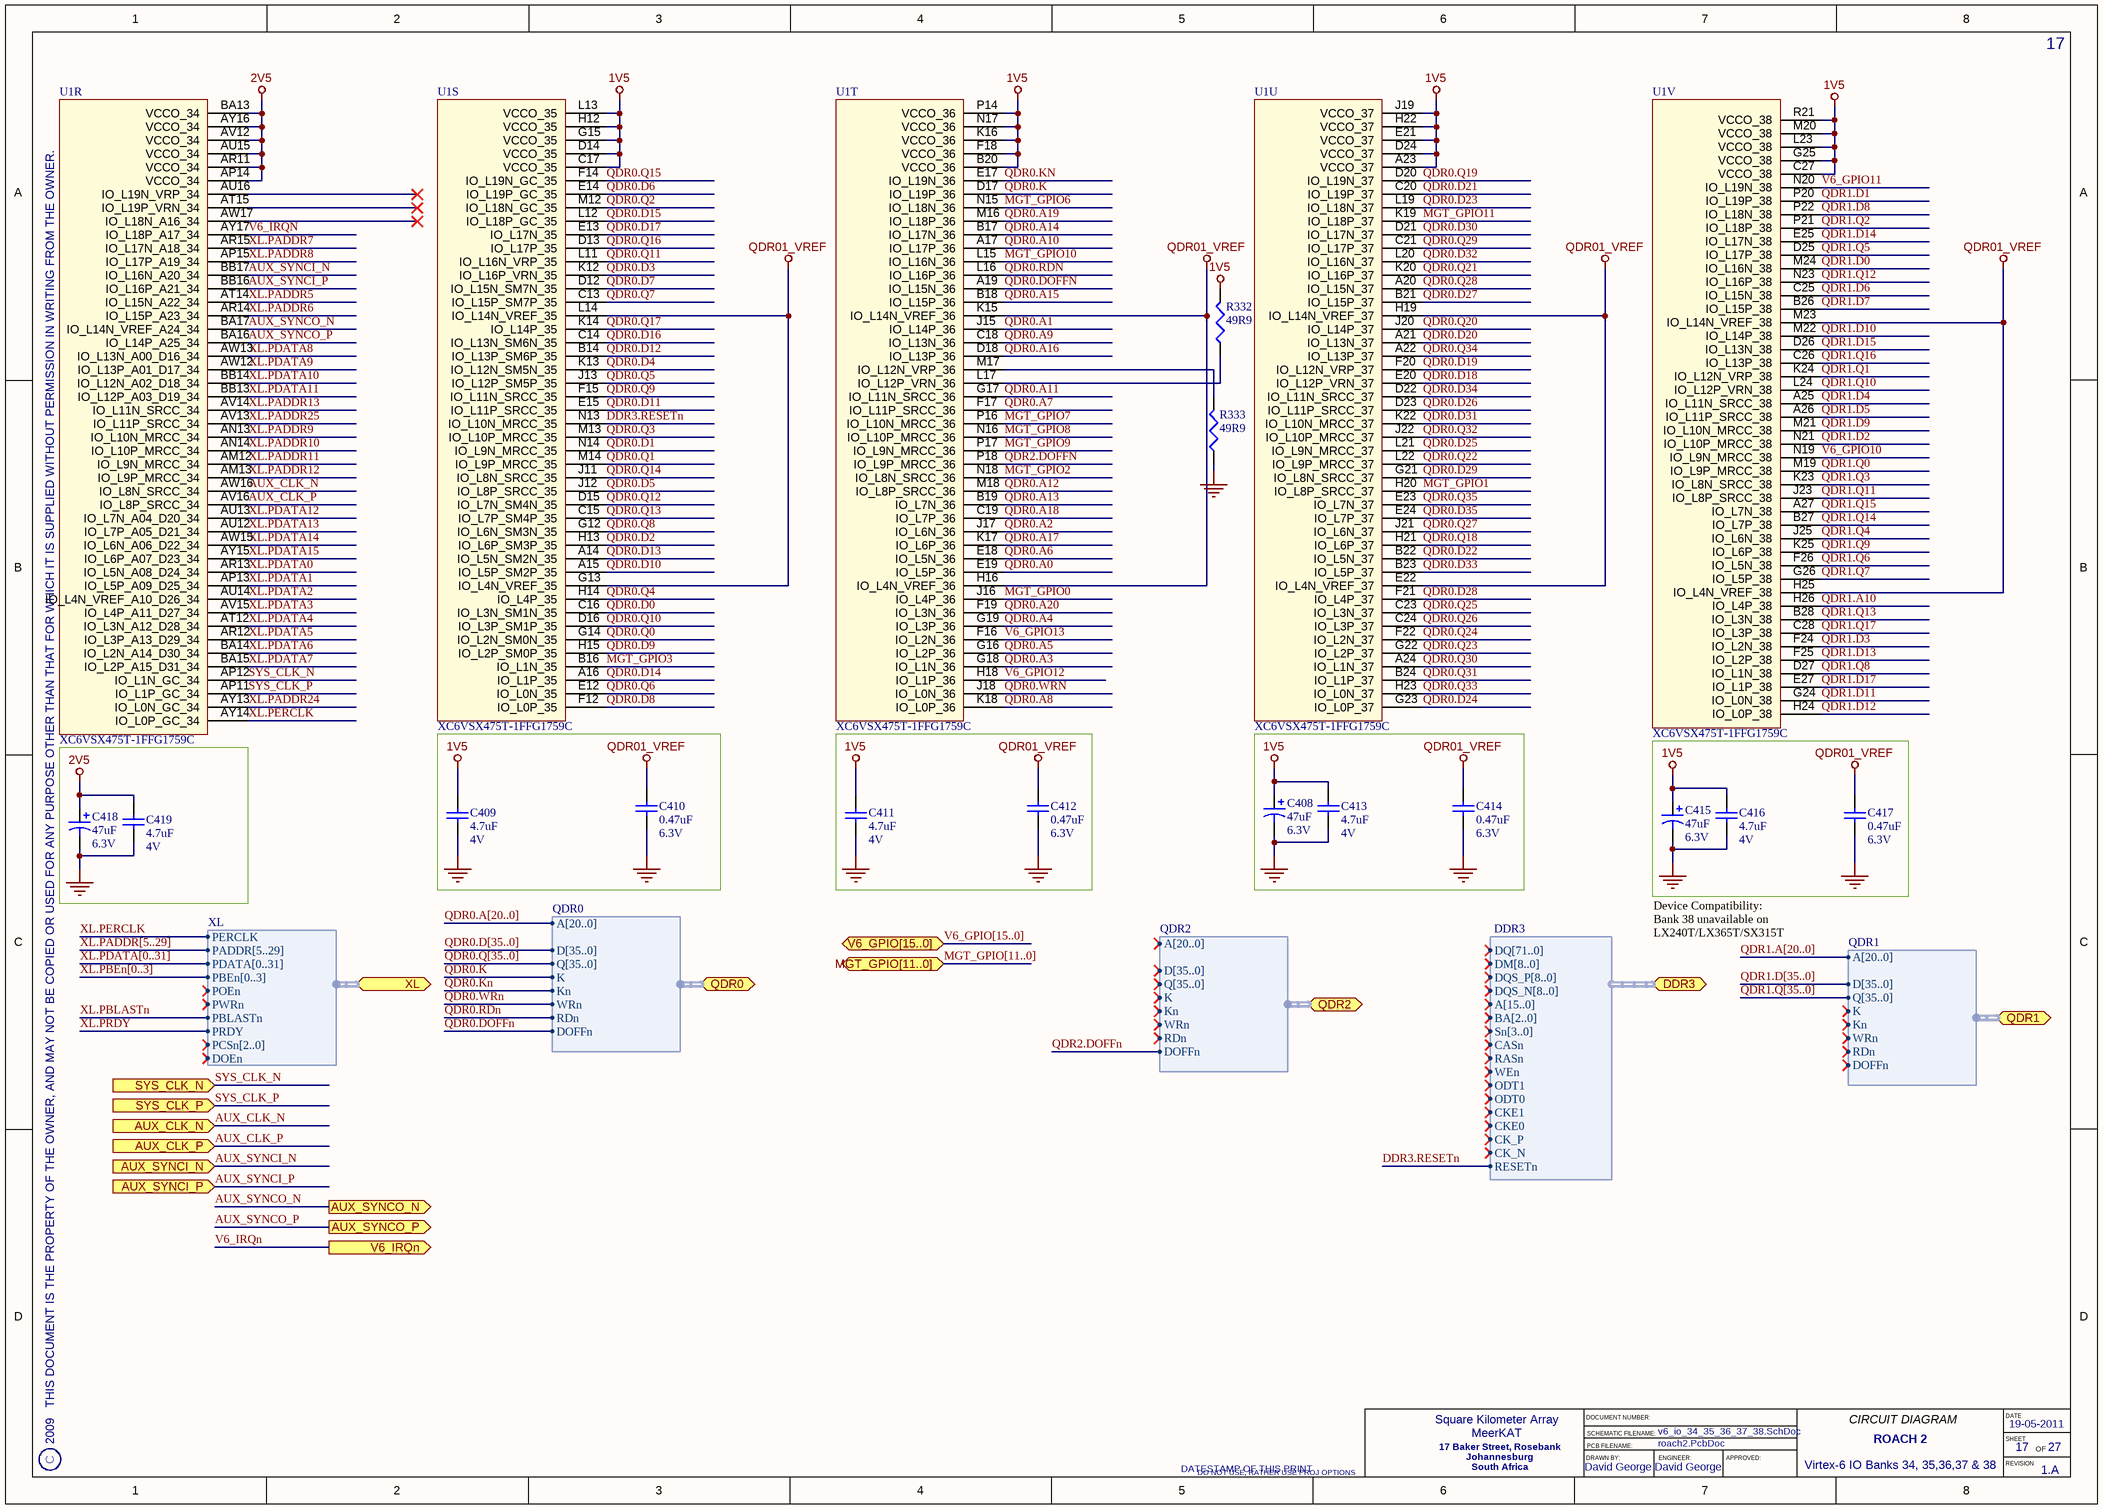
[diagram p17: v6_io_34_35_36_37_38.SchDoc]

### Parts
C408  Rating: 6.3V  [CAPMP3528X120L]  (hidden comment: 47uF)
C409  Rating: 4V  [CAPC1005X60L]  (hidden comment: 4.7uF)
C410  Rating: 6.3V  [CAPC1005X55L]  (hidden comment: 0.47uF)
C411  Rating: 4V  [CAPC1005X60L]  (hidden comment: 4.7uF)
C412  Rating: 6.3V  [CAPC1005X55L]  (hidden comment: 0.47uF)
C413  Rating: 4V  [CAPC1005X60L]  (hidden comment: 4.7uF)
C414  Rating: 6.3V  [CAPC1005X55L]  (hidden comment: 0.47uF)
C415  Rating: 6.3V  [CAPMP3528X120L]  (hidden comment: 47uF)
C416  Rating: 4V  [CAPC1005X60L]  (hidden comment: 4.7uF)
C417  Rating: 6.3V  [CAPC1005X55L]  (hidden comment: 0.47uF)
C418  Rating: 6.3V  [CAPMP3528X120L]  (hidden comment: 47uF)
C419  Rating: 4V  [CAPC1005X60L]  (hidden comment: 4.7uF)
R332  49R9  [RESC1005X40L]
R333  49R9  [RESC1005X40L]
U1  XC6VSX475T-1FFG1759C  [FFG1759]  (parts R,S,T,U,V of 39)

### Ports
AUX_CLK_N (in), AUX_CLK_P (in), AUX_SYNCI_N (in), AUX_SYNCI_P (in), AUX_SYNCO_N (out), AUX_SYNCO_P (out), DDR3 (harness DDR3), MGT_GPIO[11..0] (bidir), QDR0 (harness QDR0), QDR1 (harness QDR1), QDR2 (harness QDR2), SYS_CLK_N (in), SYS_CLK_P (in), V6_GPIO[15..0] (bidir), V6_IRQn (out), XL (harness XL)

### Harnesses
DDR3: DQ[71..0], DM[8..0], DQS_P[8..0], DQS_N[8..0], A[15..0], BA[2..0], Sn[3..0], CASn, RASn, WEn, ODT1, ODT0, CKE1, CKE0, CK_P, CK_N, RESETn
QDR0: A[20..0], D[35..0], Q[35..0], K, Kn, WRn, RDn, DOFFn
QDR2: A[20..0], D[35..0], Q[35..0], K, Kn, WRn, RDn, DOFFn
QDR1: A[20..0], D[35..0], Q[35..0], K, Kn, WRn, RDn, DOFFn
XL: PERCLK, PADDR[5..29], PDATA[0..31], PBEn[0..3], POEn, PWRn, PBLASTn, PRDY, PCSn[2..0], DOEn

### Nets
1V5: C408.1 C409.2 C411.2 C413.2 C415.1 C416.2 R332.2 U1.A23(VCCO_37) U1.B20(VCCO_36) U1.C17(VCCO_35) U1.C27(VCCO_38) U1.D14(VCCO_35) U1.D24(VCCO_37) U1.E21(VCCO_37) U1.F18(VCCO_36) U1.G15(VCCO_35) U1.G25(VCCO_38) U1.H12(VCCO_35) U1.H22(VCCO_37) U1.J19(VCCO_37) U1.K16(VCCO_36) U1.L13(VCCO_35) U1.L23(VCCO_38) U1.M20(VCCO_38) U1.N17(VCCO_36) U1.P14(VCCO_36) U1.R21(VCCO_38)
2V5: C418.1 C419.2 U1.AP14(VCCO_34) U1.AR11(VCCO_34) U1.AU15(VCCO_34) U1.AV12(VCCO_34) U1.AY16(VCCO_34) U1.BA13(VCCO_34)
GND: C408.2 C409.1 C410.1 C411.1 C412.1 C413.1 C414.1 C415.2 C416.1 C417.1 C418.2 C419.1 R333.1
QDR01_VREF: C410.2 C412.2 C414.2 C417.2 U1.E22(IO_L4N_VREF_37) U1.G13(IO_L4N_VREF_35) U1.H16(IO_L4N_VREF_36) U1.H19(IO_L14N_VREF_37) U1.H25(IO_L4N_VREF_38) U1.K15(IO_L14N_VREF_36) U1.L14(IO_L14N_VREF_35) U1.M23(IO_L14N_VREF_38)
AUX_CLK_N: U1.AW16(IO_L8N_SRCC_34) ; port AUX_CLK_N
AUX_CLK_P: U1.AV16(IO_L8P_SRCC_34) ; port AUX_CLK_P
AUX_SYNCI_N: U1.BB17(IO_L16N_A20_34) ; port AUX_SYNCI_N
AUX_SYNCI_P: U1.BB16(IO_L16P_A21_34) ; port AUX_SYNCI_P
AUX_SYNCO_N: U1.BA17(IO_L14N_VREF_A24_34) ; port AUX_SYNCO_N
AUX_SYNCO_P: U1.BA16(IO_L14P_A25_34) ; port AUX_SYNCO_P
DDR3.RESETn: U1.N13(IO_L10N_MRCC_35) ; port DDR3.RESETn
MGT_GPIO0: U1.J16(IO_L4P_36)
MGT_GPIO1: U1.H20(IO_L8P_SRCC_37)
MGT_GPIO2: U1.N18(IO_L8N_SRCC_36)
MGT_GPIO3: U1.B16(IO_L1N_35)
MGT_GPIO6: U1.N15(IO_L18N_36)
MGT_GPIO7: U1.P16(IO_L10N_MRCC_36)
MGT_GPIO8: U1.N16(IO_L10P_MRCC_36)
MGT_GPIO9: U1.P17(IO_L9N_MRCC_36)
MGT_GPIO10: U1.L15(IO_L16N_36)
MGT_GPIO11: U1.K19(IO_L18P_37)
QDR0.A0: U1.E19(IO_L5P_36)
QDR0.A1: U1.J15(IO_L14P_36)
QDR0.A2: U1.J17(IO_L6N_36)
QDR0.A3: U1.G18(IO_L1N_36)
QDR0.A4: U1.G19(IO_L3P_36)
QDR0.A5: U1.G16(IO_L2P_36)
QDR0.A6: U1.E18(IO_L5N_36)
QDR0.A7: U1.F17(IO_L11P_SRCC_36)
QDR0.A8: U1.K18(IO_L0P_36)
QDR0.A9: U1.C18(IO_L13N_36)
QDR0.A10: U1.A17(IO_L17P_36)
QDR0.A11: U1.G17(IO_L11N_SRCC_36)
QDR0.A12: U1.M18(IO_L8P_SRCC_36)
QDR0.A13: U1.B19(IO_L7N_36)
QDR0.A14: U1.B17(IO_L17N_36)
QDR0.A15: U1.B18(IO_L15P_36)
QDR0.A16: U1.D18(IO_L13P_36)
QDR0.A17: U1.K17(IO_L6P_36)
QDR0.A18: U1.C19(IO_L7P_36)
QDR0.A19: U1.M16(IO_L18P_36)
QDR0.A20: U1.F19(IO_L3N_36)
QDR0.D0: U1.C16(IO_L3N_SM1N_35)
QDR0.D1: U1.N14(IO_L9N_MRCC_35)
QDR0.D2: U1.H13(IO_L6P_SM3P_35)
QDR0.D3: U1.K12(IO_L16P_VRN_35)
QDR0.D4: U1.K13(IO_L12N_SM5N_35)
QDR0.D5: U1.J12(IO_L8P_SRCC_35)
QDR0.D6: U1.E14(IO_L19P_GC_35)
QDR0.D7: U1.D12(IO_L15N_SM7N_35)
QDR0.D8: U1.F12(IO_L0P_35)
QDR0.D9: U1.H15(IO_L2P_SM0P_35)
QDR0.D10: U1.A15(IO_L5P_SM2P_35)
QDR0.D11: U1.E15(IO_L11P_SRCC_35)
QDR0.D12: U1.B14(IO_L13P_SM6P_35)
QDR0.D13: U1.A14(IO_L5N_SM2N_35)
QDR0.D14: U1.A16(IO_L1P_35)
QDR0.D15: U1.L12(IO_L18P_GC_35)
QDR0.D16: U1.C14(IO_L13N_SM6N_35)
QDR0.D17: U1.E13(IO_L17N_35)
QDR0.D18: U1.E20(IO_L12P_VRN_37)
QDR0.D19: U1.F20(IO_L12N_VRP_37)
QDR0.D20: U1.A21(IO_L13N_37)
QDR0.D21: U1.C20(IO_L19P_37)
QDR0.D22: U1.B22(IO_L5N_37)
QDR0.D23: U1.L19(IO_L18N_37)
QDR0.D24: U1.G23(IO_L0P_37)
QDR0.D25: U1.L21(IO_L9N_MRCC_37)
QDR0.D26: U1.D23(IO_L11P_SRCC_37)
QDR0.D27: U1.B21(IO_L15P_37)
QDR0.D28: U1.F21(IO_L4P_37)
QDR0.D29: U1.G21(IO_L8N_SRCC_37)
QDR0.D30: U1.D21(IO_L17N_37)
QDR0.D31: U1.K22(IO_L10N_MRCC_37)
QDR0.D32: U1.L20(IO_L16N_37)
QDR0.D33: U1.B23(IO_L5P_37)
QDR0.D34: U1.D22(IO_L11N_SRCC_37)
QDR0.D35: U1.E24(IO_L7P_37)
QDR0.DOFFn: U1.A19(IO_L15N_36) ; port QDR0.DOFFn
QDR0.K: U1.D17(IO_L19P_36) ; port QDR0.K
QDR0.Kn: U1.E17(IO_L19N_36) ; port QDR0.Kn
QDR0.Q0: U1.G14(IO_L2N_SM0N_35)
QDR0.Q1: U1.M14(IO_L9P_MRCC_35)
QDR0.Q2: U1.M12(IO_L18N_GC_35)
QDR0.Q3: U1.M13(IO_L10P_MRCC_35)
QDR0.Q4: U1.H14(IO_L4P_35)
QDR0.Q5: U1.J13(IO_L12P_SM5P_35)
QDR0.Q6: U1.E12(IO_L0N_35)
QDR0.Q7: U1.C13(IO_L15P_SM7P_35)
QDR0.Q8: U1.G12(IO_L6N_SM3N_35)
QDR0.Q9: U1.F15(IO_L11N_SRCC_35)
QDR0.Q10: U1.D16(IO_L3P_SM1P_35)
QDR0.Q11: U1.L11(IO_L16N_VRP_35)
QDR0.Q12: U1.D15(IO_L7N_SM4N_35)
QDR0.Q13: U1.C15(IO_L7P_SM4P_35)
QDR0.Q14: U1.J11(IO_L8N_SRCC_35)
QDR0.Q15: U1.F14(IO_L19N_GC_35)
QDR0.Q16: U1.D13(IO_L17P_35)
QDR0.Q17: U1.K14(IO_L14P_35)
QDR0.Q18: U1.H21(IO_L6P_37)
QDR0.Q19: U1.D20(IO_L19N_37)
QDR0.Q20: U1.J20(IO_L14P_37)
QDR0.Q21: U1.K20(IO_L16P_37)
QDR0.Q22: U1.L22(IO_L9P_MRCC_37)
QDR0.Q23: U1.G22(IO_L2P_37)
QDR0.Q24: U1.F22(IO_L2N_37)
QDR0.Q25: U1.C23(IO_L3N_37)
QDR0.Q26: U1.C24(IO_L3P_37)
QDR0.Q27: U1.J21(IO_L6N_37)
QDR0.Q28: U1.A20(IO_L15N_37)
QDR0.Q29: U1.C21(IO_L17P_37)
QDR0.Q30: U1.A24(IO_L1N_37)
QDR0.Q31: U1.B24(IO_L1P_37)
QDR0.Q32: U1.J22(IO_L10P_MRCC_37)
QDR0.Q33: U1.H23(IO_L0N_37)
QDR0.Q34: U1.A22(IO_L13P_37)
QDR0.Q35: U1.E23(IO_L7N_37)
QDR0.RDn: U1.L16(IO_L16P_36) ; port QDR0.RDn
QDR0.WRn: U1.J18(IO_L0N_36) ; port QDR0.WRn
QDR1.A10: U1.H26(IO_L4P_38)
QDR1.D0: U1.M24(IO_L16N_38)
QDR1.D1: U1.P20(IO_L19P_38)
QDR1.D2: U1.N21(IO_L10P_MRCC_38)
QDR1.D3: U1.F24(IO_L2N_38)
QDR1.D4: U1.A25(IO_L11N_SRCC_38)
QDR1.D5: U1.A26(IO_L11P_SRCC_38)
QDR1.D6: U1.C25(IO_L15N_38)
QDR1.D7: U1.B26(IO_L15P_38)
QDR1.D8: U1.P22(IO_L18N_38)
QDR1.D9: U1.M21(IO_L10N_MRCC_38)
QDR1.D10: U1.M22(IO_L14P_38)
QDR1.D11: U1.G24(IO_L0N_38)
QDR1.D12: U1.H24(IO_L0P_38)
QDR1.D13: U1.F25(IO_L2P_38)
QDR1.D14: U1.E25(IO_L17N_38)
QDR1.D15: U1.D26(IO_L13N_38)
QDR1.D17: U1.E27(IO_L1P_38)
QDR1.Q0: U1.M19(IO_L9P_MRCC_38)
QDR1.Q1: U1.K24(IO_L12N_VRP_38)
QDR1.Q2: U1.P21(IO_L18P_38)
QDR1.Q3: U1.K23(IO_L8N_SRCC_38)
QDR1.Q4: U1.J25(IO_L6N_38)
QDR1.Q5: U1.D25(IO_L17P_38)
QDR1.Q6: U1.F26(IO_L5N_38)
QDR1.Q7: U1.G26(IO_L5P_38)
QDR1.Q8: U1.D27(IO_L1N_38)
QDR1.Q9: U1.K25(IO_L6P_38)
QDR1.Q10: U1.L24(IO_L12P_VRN_38)
QDR1.Q11: U1.J23(IO_L8P_SRCC_38)
QDR1.Q12: U1.N23(IO_L16P_38)
QDR1.Q13: U1.B28(IO_L3N_38)
QDR1.Q14: U1.B27(IO_L7P_38)
QDR1.Q15: U1.A27(IO_L7N_38)
QDR1.Q16: U1.C26(IO_L13P_38)
QDR1.Q17: U1.C28(IO_L3P_38)
QDR2.DOFFn: U1.P18(IO_L9P_MRCC_36) ; port QDR2.DOFFn
SYS_CLK_N: U1.AP12(IO_L1N_GC_34) ; port SYS_CLK_N
SYS_CLK_P: U1.AP11(IO_L1P_GC_34) ; port SYS_CLK_P
V6_GPIO10: U1.N19(IO_L9N_MRCC_38)
V6_GPIO11: U1.N20(IO_L19N_38)
V6_GPIO12: U1.H18(IO_L1P_36)
V6_GPIO13: U1.F16(IO_L2N_36)
V6_IRQn: U1.AY17(IO_L18P_A17_34) ; port V6_IRQn
XL.PADDR5: U1.AT14(IO_L15N_A22_34)
XL.PADDR6: U1.AR14(IO_L15P_A23_34)
XL.PADDR7: U1.AR15(IO_L17N_A18_34)
XL.PADDR8: U1.AP15(IO_L17P_A19_34)
XL.PADDR9: U1.AN13(IO_L10N_MRCC_34)
XL.PADDR10: U1.AN14(IO_L10P_MRCC_34)
XL.PADDR11: U1.AM12(IO_L9N_MRCC_34)
XL.PADDR12: U1.AM13(IO_L9P_MRCC_34)
XL.PADDR13: U1.AV14(IO_L11N_SRCC_34)
XL.PADDR24: U1.AY13(IO_L0N_GC_34)
XL.PADDR25: U1.AV13(IO_L11P_SRCC_34)
XL.PDATA0: U1.AR13(IO_L5N_A08_D24_34)
XL.PDATA1: U1.AP13(IO_L5P_A09_D25_34)
XL.PDATA2: U1.AU14(IO_L4N_VREF_A10_D26_34)
XL.PDATA3: U1.AV15(IO_L4P_A11_D27_34)
XL.PDATA4: U1.AT12(IO_L3N_A12_D28_34)
XL.PDATA5: U1.AR12(IO_L3P_A13_D29_34)
XL.PDATA6: U1.BA14(IO_L2N_A14_D30_34)
XL.PDATA7: U1.BA15(IO_L2P_A15_D31_34)
XL.PDATA8: U1.AW13(IO_L13N_A00_D16_34)
XL.PDATA9: U1.AW12(IO_L13P_A01_D17_34)
XL.PDATA10: U1.BB14(IO_L12N_A02_D18_34)
XL.PDATA11: U1.BB13(IO_L12P_A03_D19_34)
XL.PDATA12: U1.AU13(IO_L7N_A04_D20_34)
XL.PDATA13: U1.AU12(IO_L7P_A05_D21_34)
XL.PDATA14: U1.AW15(IO_L6N_A06_D22_34)
XL.PDATA15: U1.AY15(IO_L6P_A07_D23_34)
XL.PERCLK: U1.AY14(IO_L0P_GC_34) ; port XL.PERCLK
NetR332_1: R332.1 U1.L17(IO_L12P_VRN_36)
NetR333_2: R333.2 U1.M17(IO_L12N_VRP_36)

Not connected (* = marked no-connect by the designer): U1 AT15(IO_L19P_VRN_34)* AU16(IO_L19N_VRP_34)* AW17(IO_L18N_A16_34)*

### Buses and harness runs
bus MGT_GPIO[11..0] = port MGT_GPIO[11..0]
bus QDR0.A[20..0]
bus QDR0.D[35..0]
bus QDR0.Q[35..0]
bus QDR1.A[20..0]
bus QDR1.D[35..0]
bus QDR1.Q[35..0]
bus V6_GPIO[15..0] = port V6_GPIO[15..0]
bus XL.PADDR[5..29]
bus XL.PBEn[0..3]
bus XL.PDATA[0..31]

### Notes on the sheet
- Device Compatibility:
  Bank 38 unavailable on LX240T/LX365T/SX315T
- 2009   THIS DOCUMENT IS THE PROPERTY OF THE OWNER, AND MAY NOT BE COPIED OR USED FOR ANY PURPOSE OTHER THAN THAT FOR WHICH IT IS SUPPLIED WITHOUT PERMISSION IN WRITING FROM THE OWNER.
- C
- DATESTAMP OF THIS PRINT
- DRAWN BY:
- DOCUMENT NUMBER:
- SCHEMATIC FILENAME:
- PCB FILENAME:
- ENGINEER:
- APPROVED:
- CIRCUIT DIAGRAM
- DATE
- SHEET
- REVISION
- OF

### Library data of the parts
C408 C415 C418 = CAP-TAN-1: as C385 on sheet v6_io_23_24_25_26; POD number: CAP-TAN-1; Value: 47uF; RoHS: Y; Sort Value: 47; Category: Capacitors; Subcategory: Tantalum
C409 C411 C413 C416 C419 = CAP-CER-11: as C386 on sheet v6_io_23_24_25_26; POD number: CAP-CER-11; Value: 4.7uF; RoHS: Y; Sort Value: 4.7; Category: Capacitors; Subcategory: Ceramic
C410 C412 C414 C417 = CAP-CER-7: as C398 on sheet v6_io_27_28_32_33; POD number: CAP-CER-7; Value: 0.47uF; RoHS: Y; Sort Value: 0.47; Category: Capacitors; Subcategory: Ceramic
R332 R333 = RES-TF-10: as R328 on sheet v6_io_23_24_25_26; POD number: RES-TF-10; Value: 49R9; Sort Value: 49.9; Category: Resistors; Subcategory: ThickFilm; HelpURL: *.pdf
U1 = IC-PLD-0: as U1 on sheet v6_io_23_24_25_26; POD number: IC-PLD-0; PartNum: XC6VSX475T-1FFG1759C; RoHS: Y; Category: IC; Subcategory: PLD

## Sheet zdoks.SchDoc: ZDOK Interfaces
size A3; Date: DO NOT USE, RATHER USE PROJ OPTIONS; DrawnBy: DO NOT USE, RATHER USE PROJ OPTIONS; Engineer: DO NOT USE, RATHER USE PROJ OPTIONS; Organization: DO NOT USE, RATHER USE PROJ OPTIONS; DocumentNumber: DO NOT USE, RATHER USE PROJ OPTIONS; Revision: DO NOT USE, RATHER USE PROJ OPTIONS; SheetNumber: 22; SheetTotal: 27; SCH_Sheet_Filename: zdoks.SchDoc; CurrentTime: DO NOT USE, RATHER USE PROJ OPTIONS; Time: DO NOT USE, RATHER USE PROJ OPTIONS; DocumentFullPathAndName: DO NOT USE, RATHER USE PROJ OPTIONS; DocumentName: DO NOT USE, RATHER USE PROJ OPTIONS; ModifiedDate: DO NOT USE, RATHER USE PROJ OPTIONS; ImagePath: DO NOT USE, RATHER USE PROJ OPTIONS
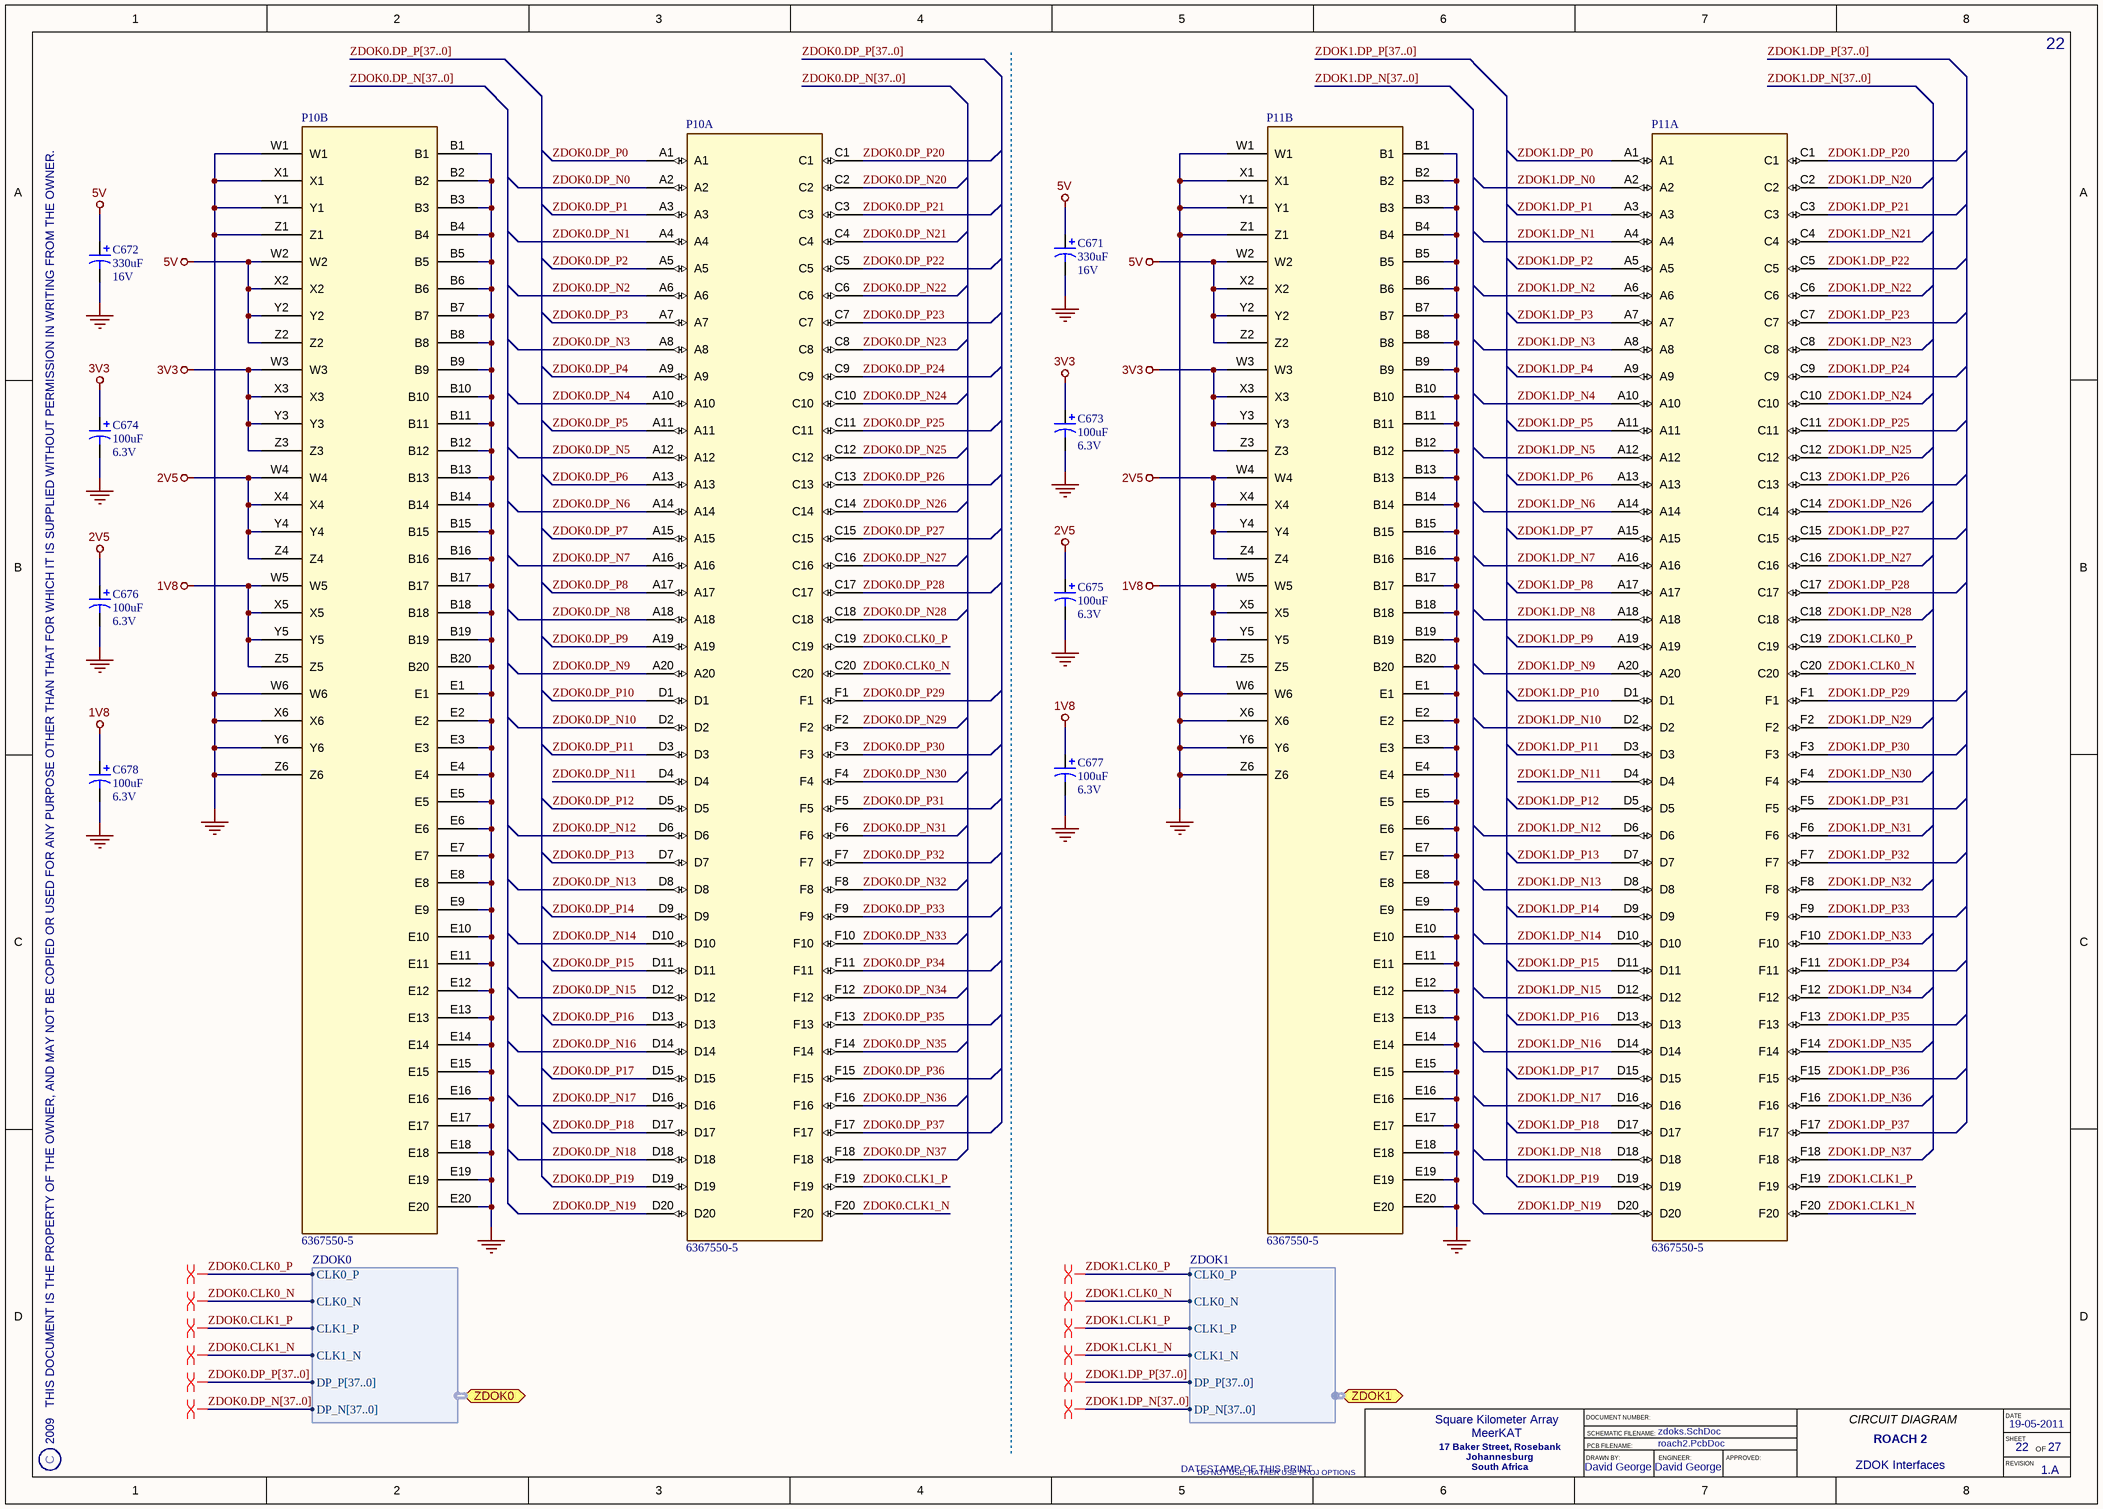
[diagram p18: zdoks.SchDoc]

### Parts
C671  Rating: 16V  [CAPMP7263X380L]  (hidden comment: 330uF)
C672  Rating: 16V  [CAPMP7263X380L]  (hidden comment: 330uF)
C673  Rating: 6.3V  [CAPMP3528X210L]  (hidden comment: 100uF)
C674  Rating: 6.3V  [CAPMP3528X210L]  (hidden comment: 100uF)
C675  Rating: 6.3V  [CAPMP3528X210L]  (hidden comment: 100uF)
C676  Rating: 6.3V  [CAPMP3528X210L]  (hidden comment: 100uF)
C677  Rating: 6.3V  [CAPMP3528X210L]  (hidden comment: 100uF)
C678  Rating: 6.3V  [CAPMP3528X210L]  (hidden comment: 100uF)
P10  6367550-5  [TYCO_6367550-5]  (parts A,B of 2)
P11  6367550-5  [TYCO_6367550-5]  (parts A,B of 2)

### Ports
ZDOK0 (harness ZDOK0), ZDOK1 (harness ZDOK1)

### Harnesses
ZDOK0: CLK0_P, CLK0_N, CLK1_P, CLK1_N, DP_P[37..0], DP_N[37..0]
ZDOK1: CLK0_P, CLK0_N, CLK1_P, CLK1_N, DP_P[37..0], DP_N[37..0]

### Nets
1V8: C677.1 C678.1 P10.W5 P10.X5 P10.Y5 P10.Z5 P11.W5 P11.X5 P11.Y5 P11.Z5
2V5: C675.1 C676.1 P10.W4 P10.X4 P10.Y4 P10.Z4 P11.W4 P11.X4 P11.Y4 P11.Z4
3V3: C673.1 C674.1 P10.W3 P10.X3 P10.Y3 P10.Z3 P11.W3 P11.X3 P11.Y3 P11.Z3
5V: C671.1 C672.1 P10.W2 P10.X2 P10.Y2 P10.Z2 P11.W2 P11.X2 P11.Y2 P11.Z2
GND: C671.2 C672.2 C673.2 C674.2 C675.2 C676.2 C677.2 C678.2 P10.B1 P10.B2 P10.B3 P10.B4 P10.B5 P10.B6 P10.B7 P10.B8 P10.B9 P10.B10 P10.B11 P10.B12 P10.B13 P10.B14 P10.B15 P10.B16 P10.B17 P10.B18 P10.B19 P10.B20 P10.E1 P10.E2 P10.E3 P10.E4 P10.E5 P10.E6 P10.E7 P10.E8 P10.E9 P10.E10 P10.E11 P10.E12 P10.E13 P10.E14 P10.E15 P10.E16 P10.E17 P10.E18 P10.E19 P10.E20 P10.W1 P10.W6 P10.X1 P10.X6 P10.Y1 P10.Y6 P10.Z1 P10.Z6 P11.B1 P11.B2 P11.B3 P11.B4 P11.B5 P11.B6 P11.B7 P11.B8 P11.B9 P11.B10 P11.B11 P11.B12 P11.B13 P11.B14 P11.B15 P11.B16 P11.B17 P11.B18 P11.B19 P11.B20 P11.E1 P11.E2 P11.E3 P11.E4 P11.E5 P11.E6 P11.E7 P11.E8 P11.E9 P11.E10 P11.E11 P11.E12 P11.E13 P11.E14 P11.E15 P11.E16 P11.E17 P11.E18 P11.E19 P11.E20 P11.W1 P11.W6 P11.X1 P11.X6 P11.Y1 P11.Y6 P11.Z1 P11.Z6
ZDOK0.CLK0_N: P10.C20 ; port ZDOK0.CLK0_N
ZDOK0.CLK0_P: P10.C19 ; port ZDOK0.CLK0_P
ZDOK0.CLK1_N: P10.F20 ; port ZDOK0.CLK1_N
ZDOK0.CLK1_P: P10.F19 ; port ZDOK0.CLK1_P
ZDOK0.DP_N0: P10.A2
ZDOK0.DP_N1: P10.A4
ZDOK0.DP_N2: P10.A6
ZDOK0.DP_N3: P10.A8
ZDOK0.DP_N4: P10.A10
ZDOK0.DP_N5: P10.A12
ZDOK0.DP_N6: P10.A14
ZDOK0.DP_N7: P10.A16
ZDOK0.DP_N8: P10.A18
ZDOK0.DP_N9: P10.A20
ZDOK0.DP_N10: P10.D2
ZDOK0.DP_N11: P10.D4
ZDOK0.DP_N12: P10.D6
ZDOK0.DP_N13: P10.D8
ZDOK0.DP_N14: P10.D10
ZDOK0.DP_N15: P10.D12
ZDOK0.DP_N16: P10.D14
ZDOK0.DP_N17: P10.D16
ZDOK0.DP_N18: P10.D18
ZDOK0.DP_N19: P10.D20
ZDOK0.DP_N20: P10.C2
ZDOK0.DP_N21: P10.C4
ZDOK0.DP_N22: P10.C6
ZDOK0.DP_N23: P10.C8
ZDOK0.DP_N24: P10.C10
ZDOK0.DP_N25: P10.C12
ZDOK0.DP_N26: P10.C14
ZDOK0.DP_N27: P10.C16
ZDOK0.DP_N28: P10.C18
ZDOK0.DP_N29: P10.F2
ZDOK0.DP_N30: P10.F4
ZDOK0.DP_N31: P10.F6
ZDOK0.DP_N32: P10.F8
ZDOK0.DP_N33: P10.F10
ZDOK0.DP_N34: P10.F12
ZDOK0.DP_N35: P10.F14
ZDOK0.DP_N36: P10.F16
ZDOK0.DP_N37: P10.F18
ZDOK0.DP_P0: P10.A1
ZDOK0.DP_P1: P10.A3
ZDOK0.DP_P2: P10.A5
ZDOK0.DP_P3: P10.A7
ZDOK0.DP_P4: P10.A9
ZDOK0.DP_P5: P10.A11
ZDOK0.DP_P6: P10.A13
ZDOK0.DP_P7: P10.A15
ZDOK0.DP_P8: P10.A17
ZDOK0.DP_P9: P10.A19
ZDOK0.DP_P10: P10.D1
ZDOK0.DP_P11: P10.D3
ZDOK0.DP_P12: P10.D5
ZDOK0.DP_P13: P10.D7
ZDOK0.DP_P14: P10.D9
ZDOK0.DP_P15: P10.D11
ZDOK0.DP_P16: P10.D13
ZDOK0.DP_P17: P10.D15
ZDOK0.DP_P18: P10.D17
ZDOK0.DP_P19: P10.D19
ZDOK0.DP_P20: P10.C1
ZDOK0.DP_P21: P10.C3
ZDOK0.DP_P22: P10.C5
ZDOK0.DP_P23: P10.C7
ZDOK0.DP_P24: P10.C9
ZDOK0.DP_P25: P10.C11
ZDOK0.DP_P26: P10.C13
ZDOK0.DP_P27: P10.C15
ZDOK0.DP_P28: P10.C17
ZDOK0.DP_P29: P10.F1
ZDOK0.DP_P30: P10.F3
ZDOK0.DP_P31: P10.F5
ZDOK0.DP_P32: P10.F7
ZDOK0.DP_P33: P10.F9
ZDOK0.DP_P34: P10.F11
ZDOK0.DP_P35: P10.F13
ZDOK0.DP_P36: P10.F15
ZDOK0.DP_P37: P10.F17
ZDOK1.CLK0_N: P11.C20 ; port ZDOK1.CLK0_N
ZDOK1.CLK0_P: P11.C19 ; port ZDOK1.CLK0_P
ZDOK1.CLK1_N: P11.F20 ; port ZDOK1.CLK1_N
ZDOK1.CLK1_P: P11.F19 ; port ZDOK1.CLK1_P
ZDOK1.DP_N0: P11.A2
ZDOK1.DP_N1: P11.A4
ZDOK1.DP_N2: P11.A6
ZDOK1.DP_N3: P11.A8
ZDOK1.DP_N4: P11.A10
ZDOK1.DP_N5: P11.A12
ZDOK1.DP_N6: P11.A14
ZDOK1.DP_N7: P11.A16
ZDOK1.DP_N8: P11.A18
ZDOK1.DP_N9: P11.A20
ZDOK1.DP_N10: P11.D2
ZDOK1.DP_N11: P11.D4
ZDOK1.DP_N12: P11.D6
ZDOK1.DP_N13: P11.D8
ZDOK1.DP_N14: P11.D10
ZDOK1.DP_N15: P11.D12
ZDOK1.DP_N16: P11.D14
ZDOK1.DP_N17: P11.D16
ZDOK1.DP_N18: P11.D18
ZDOK1.DP_N19: P11.D20
ZDOK1.DP_N20: P11.C2
ZDOK1.DP_N21: P11.C4
ZDOK1.DP_N22: P11.C6
ZDOK1.DP_N23: P11.C8
ZDOK1.DP_N24: P11.C10
ZDOK1.DP_N25: P11.C12
ZDOK1.DP_N26: P11.C14
ZDOK1.DP_N27: P11.C16
ZDOK1.DP_N28: P11.C18
ZDOK1.DP_N29: P11.F2
ZDOK1.DP_N30: P11.F4
ZDOK1.DP_N31: P11.F6
ZDOK1.DP_N32: P11.F8
ZDOK1.DP_N33: P11.F10
ZDOK1.DP_N34: P11.F12
ZDOK1.DP_N35: P11.F14
ZDOK1.DP_N36: P11.F16
ZDOK1.DP_N37: P11.F18
ZDOK1.DP_P0: P11.A1
ZDOK1.DP_P1: P11.A3
ZDOK1.DP_P2: P11.A5
ZDOK1.DP_P3: P11.A7
ZDOK1.DP_P4: P11.A9
ZDOK1.DP_P5: P11.A11
ZDOK1.DP_P6: P11.A13
ZDOK1.DP_P7: P11.A15
ZDOK1.DP_P8: P11.A17
ZDOK1.DP_P9: P11.A19
ZDOK1.DP_P10: P11.D1
ZDOK1.DP_P11: P11.D3
ZDOK1.DP_P12: P11.D5
ZDOK1.DP_P13: P11.D7
ZDOK1.DP_P14: P11.D9
ZDOK1.DP_P15: P11.D11
ZDOK1.DP_P16: P11.D13
ZDOK1.DP_P17: P11.D15
ZDOK1.DP_P18: P11.D17
ZDOK1.DP_P19: P11.D19
ZDOK1.DP_P20: P11.C1
ZDOK1.DP_P21: P11.C3
ZDOK1.DP_P22: P11.C5
ZDOK1.DP_P23: P11.C7
ZDOK1.DP_P24: P11.C9
ZDOK1.DP_P25: P11.C11
ZDOK1.DP_P26: P11.C13
ZDOK1.DP_P27: P11.C15
ZDOK1.DP_P28: P11.C17
ZDOK1.DP_P29: P11.F1
ZDOK1.DP_P30: P11.F3
ZDOK1.DP_P31: P11.F5
ZDOK1.DP_P32: P11.F7
ZDOK1.DP_P33: P11.F9
ZDOK1.DP_P34: P11.F11
ZDOK1.DP_P35: P11.F13
ZDOK1.DP_P36: P11.F15
ZDOK1.DP_P37: P11.F17

### Buses and harness runs
bus ZDOK0.DP_N[37..0]
bus ZDOK0.DP_P[37..0]
bus ZDOK1.DP_N[37..0]
bus ZDOK1.DP_P[37..0]

### Layout directives
differential pair: (no net found under the mark), ZDOK0.CLK0_N, ZDOK0.CLK0_P, ZDOK0.CLK1_N, ZDOK0.CLK1_P, ZDOK1.CLK0_N, ZDOK1.CLK0_P, ZDOK1.CLK1_N, ZDOK1.CLK1_P

### Notes on the sheet
- 2009   THIS DOCUMENT IS THE PROPERTY OF THE OWNER, AND MAY NOT BE COPIED OR USED FOR ANY PURPOSE OTHER THAN THAT FOR WHICH IT IS SUPPLIED WITHOUT PERMISSION IN WRITING FROM THE OWNER.
- C
- DATESTAMP OF THIS PRINT
- DRAWN BY:
- DOCUMENT NUMBER:
- SCHEMATIC FILENAME:
- PCB FILENAME:
- ENGINEER:
- APPROVED:
- CIRCUIT DIAGRAM
- DATE
- SHEET
- REVISION
- OF

### Library data of the parts
C671 C672 = CAP-TAN-3: 330uF, Solid Tantalum Chip Capacitor; Manufacturer: VISHAY; PartNum: 594D337X0016R2T; Tolerance: 20%; ESR: 0.055; POD number: CAP-TAN-3; Value: 330uF; RoHS: Y; Sort Value: 330; Category: Capacitors; Subcategory: Tantalum
C673-C678 = CAP-TAN-6: 100uF, Low ESR, Tantalum Capacitor; Manufacturer: AVX; PartNum: TPSB107M006R0200; Tolerance: 20%; ESR: 0.2; POD number: CAP-TAN-6; Value: 100uF; RoHS: Y; Sort Value: 100; Category: Capacitors; Subcategory: Tantalum
P10 P11 = CONN-PCB-8: ZDOK+ Host Board Connector; Manufacturer: TYCO; POD number: CONN-PCB-8; PartNum: 6367550-5; RoHS: Y; Category: CONN; Subcategory: PCB